# EAGLE design v13 (EAGLE 9.3.0)

## Sheet 1 of 3
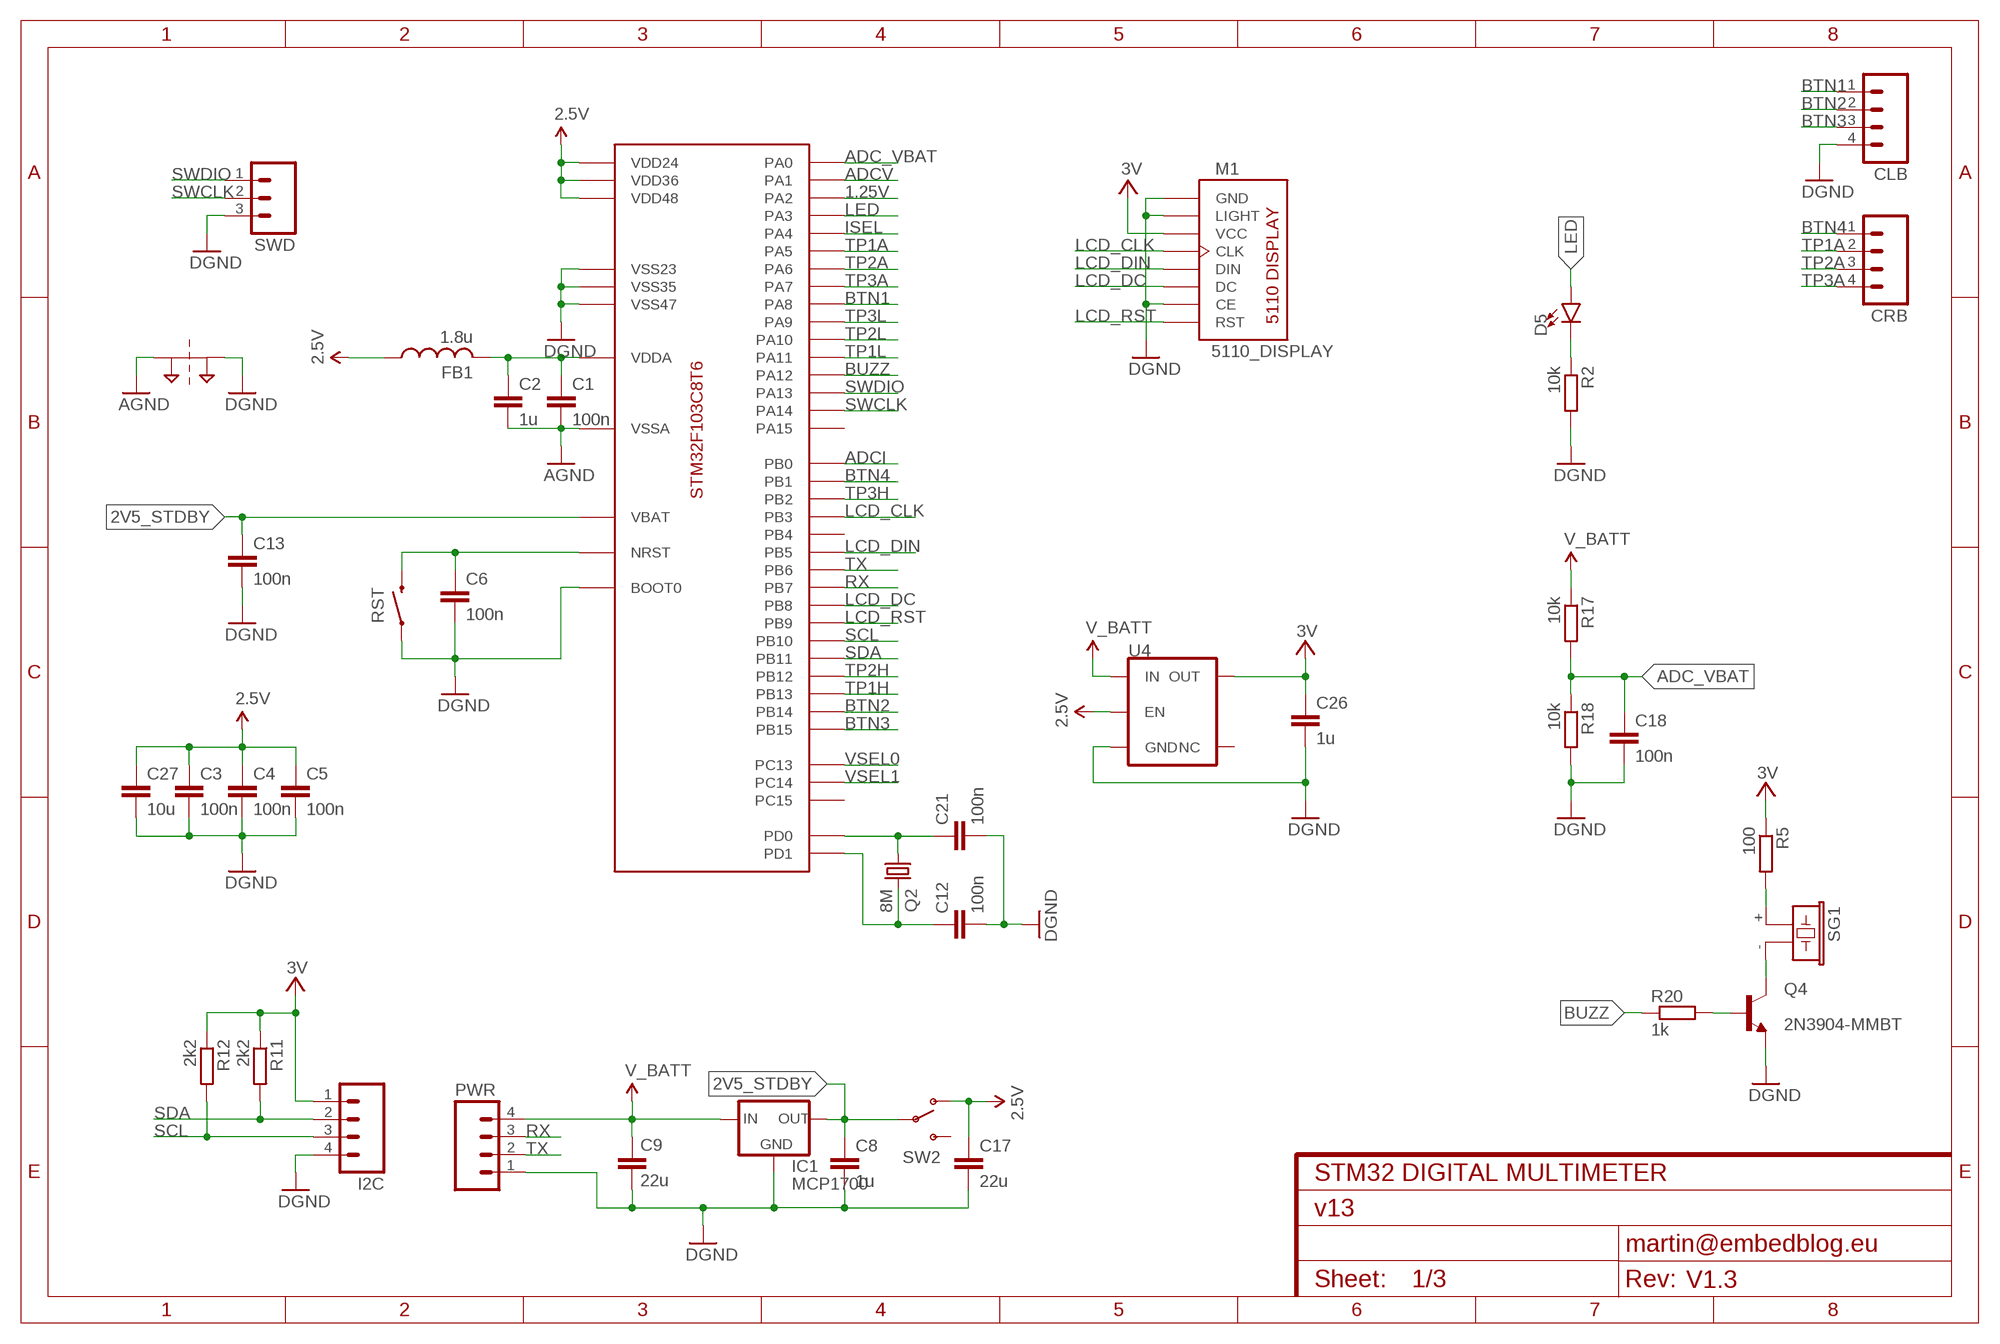
[diagram p0: schematic, sheet 1]
FRAME2 (FRAME-A4L): CNAME: STM32 DIGITAL MULTIMETER; CREVISION: V1.3; DESIGNER: martin@embedblog.eu

### Parts
C1  100n  C-EUC1206  [C1206]
C2  1u  C-EUC1206  [C1206]
C3  100n  C-EUC1206  [C1206]
C4  100n  C-EUC1206  [C1206]
C5  100n  C-EUC1206  [C1206]
C6  100n  C-EUC1206  [C1206]
C8  1u  C-EUC1206  [C1206]
C9  22u  C-EUC1206  [C1206]
C12  100n  C-EUC1206  [C1206]
C13  100n  C-EUC1206  [C1206]
C17  22u  C-EUC1206  [C1206]
C18  100n  C-EUC1206  [C1206]
C21  100n  C-EUC1206  [C1206]
C26  1u  C-EUC1206  [C1206]
C27  10u  C-EUC1206  [C1206]
CLB  M04PTH  [1X04@1]
CRB  M04PTH  [1X04@1]
D5  LED1206  [LED-1206]
FB1  1.8u  FERRITE-BEADC  [1206]
I2C  M04PTH  [1X04@1]
IC1  MCP1700  XC63FPM  [SOT23]
M1  5110_DISPLAY  [5110_LAYOUT]
PWR  M04PTH  [1X04@1]
Q2  8M  CRYSTALHC49U-V  [HC49U-V]
Q4  2N3904-MMBT  [SOT23]
R2  10k  R-EU_R1206  [R1206]
R5  100  R-EU_R1206  [R1206]
R11  2k2  R-EU_R1206  [R1206]
R12  2k2  R-EU_R1206  [R1206]
R17  10k  R-EU_R1206  [R1206]
R18  10k  R-EU_R1206  [R1206]
R20  1k  R-EU_R1206  [R1206]
RST  SWITCH-MOMENTARY-2SMD  [TACTILE-SWITCH-SMD]
SG1  F/CM12P  [F/CM12P]
SJ1  2PT_GND_TIE  [2PT_GND_TIE]
SW2  SK-12D07  [SK12SWITCH]
SWD  M03PTH  [1X03]
U4  3.3V  V_REG_AP2112K-3.3V  [SOT23-5]
U$1  STM32F103C8T6  [TQFP-48]

### Nets
1.25V: U$1.12(PA2) ; also sheet 2
2.5V: C3.1 C4.1 C5.1 C17.1 C27.1 FB1.1 SW2.IN(O) U4.3(EN) U$1.24(VDD24) U$1.36(VDD36) U$1.48(VDD48) ; also sheet 2
2V5_STDBY: C8.1 C13.1 IC1.2(OUT) SW2.P1(P) U$1.1(VBAT)
3V: C26.1 I2C.1 M1.VCC R5.1 R11.1 R12.1 U4.5(OUT) ; also sheet 2
ADC_VBAT: C18.1 R17.2 R18.1 U$1.10(PA0)
ADCI: U$1.18(PB0) ; also sheet 2
ADCV: U$1.11(PA1) ; also sheet 2
AGND: C1.2 C2.2 SJ1.P$1 U$1.8(VSSA) ; also sheet 2
BTN1: CLB.1 U$1.29(PA8)
BTN2: CLB.2 U$1.27(PB14)
BTN3: CLB.3 U$1.28(PB15)
BTN4: CRB.1 U$1.19(PB1)
BUZZ: R20.1 U$1.33(PA12)
GND: C3.2 C4.2 C5.2 C6.2 C8.2 C9.2 C12.2 C13.2 C17.2 C18.2 C21.2 C26.2 C27.2 CLB.4 I2C.4 IC1.1(GND) M1.CE M1.GND M1.LIGHT PWR.1 Q4.2(E) R2.2 R18.2 RST.1 SJ1.P$2 SWD.3 U4.2(GND) U$1.23(VSS23) U$1.35(VSS35) U$1.44(BOOT0) U$1.47(VSS47) ; supply symbol labelled DGND ; also sheet 2
ISEL: U$1.14(PA4) ; also sheet 2
LCD_CLK: M1.CLK U$1.39(PB3)
LCD_DC: M1.DC U$1.45(PB8)
LCD_DIN: M1.DIN U$1.41(PB5)
LCD_RST: M1.RST U$1.46(PB9)
LED: D5.A U$1.13(PA3)
N$1: C6.1 RST.3 U$1.7(NRST)
N$2: C21.1 Q2.1 U$1.5(PD0)
N$8: C1.1 C2.1 FB1.2 U$1.9(VDDA)
N$15: D5.C R2.1
N$16: R5.2 SG1.+
N$21: C12.1 Q2.2 U$1.6(PD1)
N$36: Q4.3(C) SG1.-
N$37: Q4.1(B) R20.2
RX: PWR.3 U$1.43(PB7)
SCL: I2C.3 R12.2 U$1.21(PB10)
SDA: I2C.2 R11.2 U$1.22(PB11)
SWCLK: SWD.2 U$1.37(PA14)
SWDIO: SWD.1 U$1.34(PA13)
TP1A: CRB.2 U$1.15(PA5) ; also sheet 2
TP1H: U$1.26(PB13) ; also sheet 2
TP1L: U$1.32(PA11) ; also sheet 2
TP2A: CRB.3 U$1.16(PA6) ; also sheet 2
TP2H: U$1.25(PB12) ; also sheet 2
TP2L: U$1.31(PA10) ; also sheet 2
TP3A: CRB.4 U$1.17(PA7) ; also sheet 2
TP3H: U$1.20(PB2) ; also sheet 2
TP3L: U$1.30(PA9) ; also sheet 2
TX: PWR.2 U$1.42(PB6)
V_BATT: C9.1 IC1.3(IN) PWR.4 R17.1 U4.1(IN) ; also sheet 3
VSEL0: U$1.2(PC13) ; also sheet 2
VSEL1: U$1.3(PC14) ; also sheet 2
Unconnected: SW2.P2(S) U4.4(NC) U$1.4(PC15) U$1.38(PA15) U$1.40(PB4)

## Sheet 2 of 3
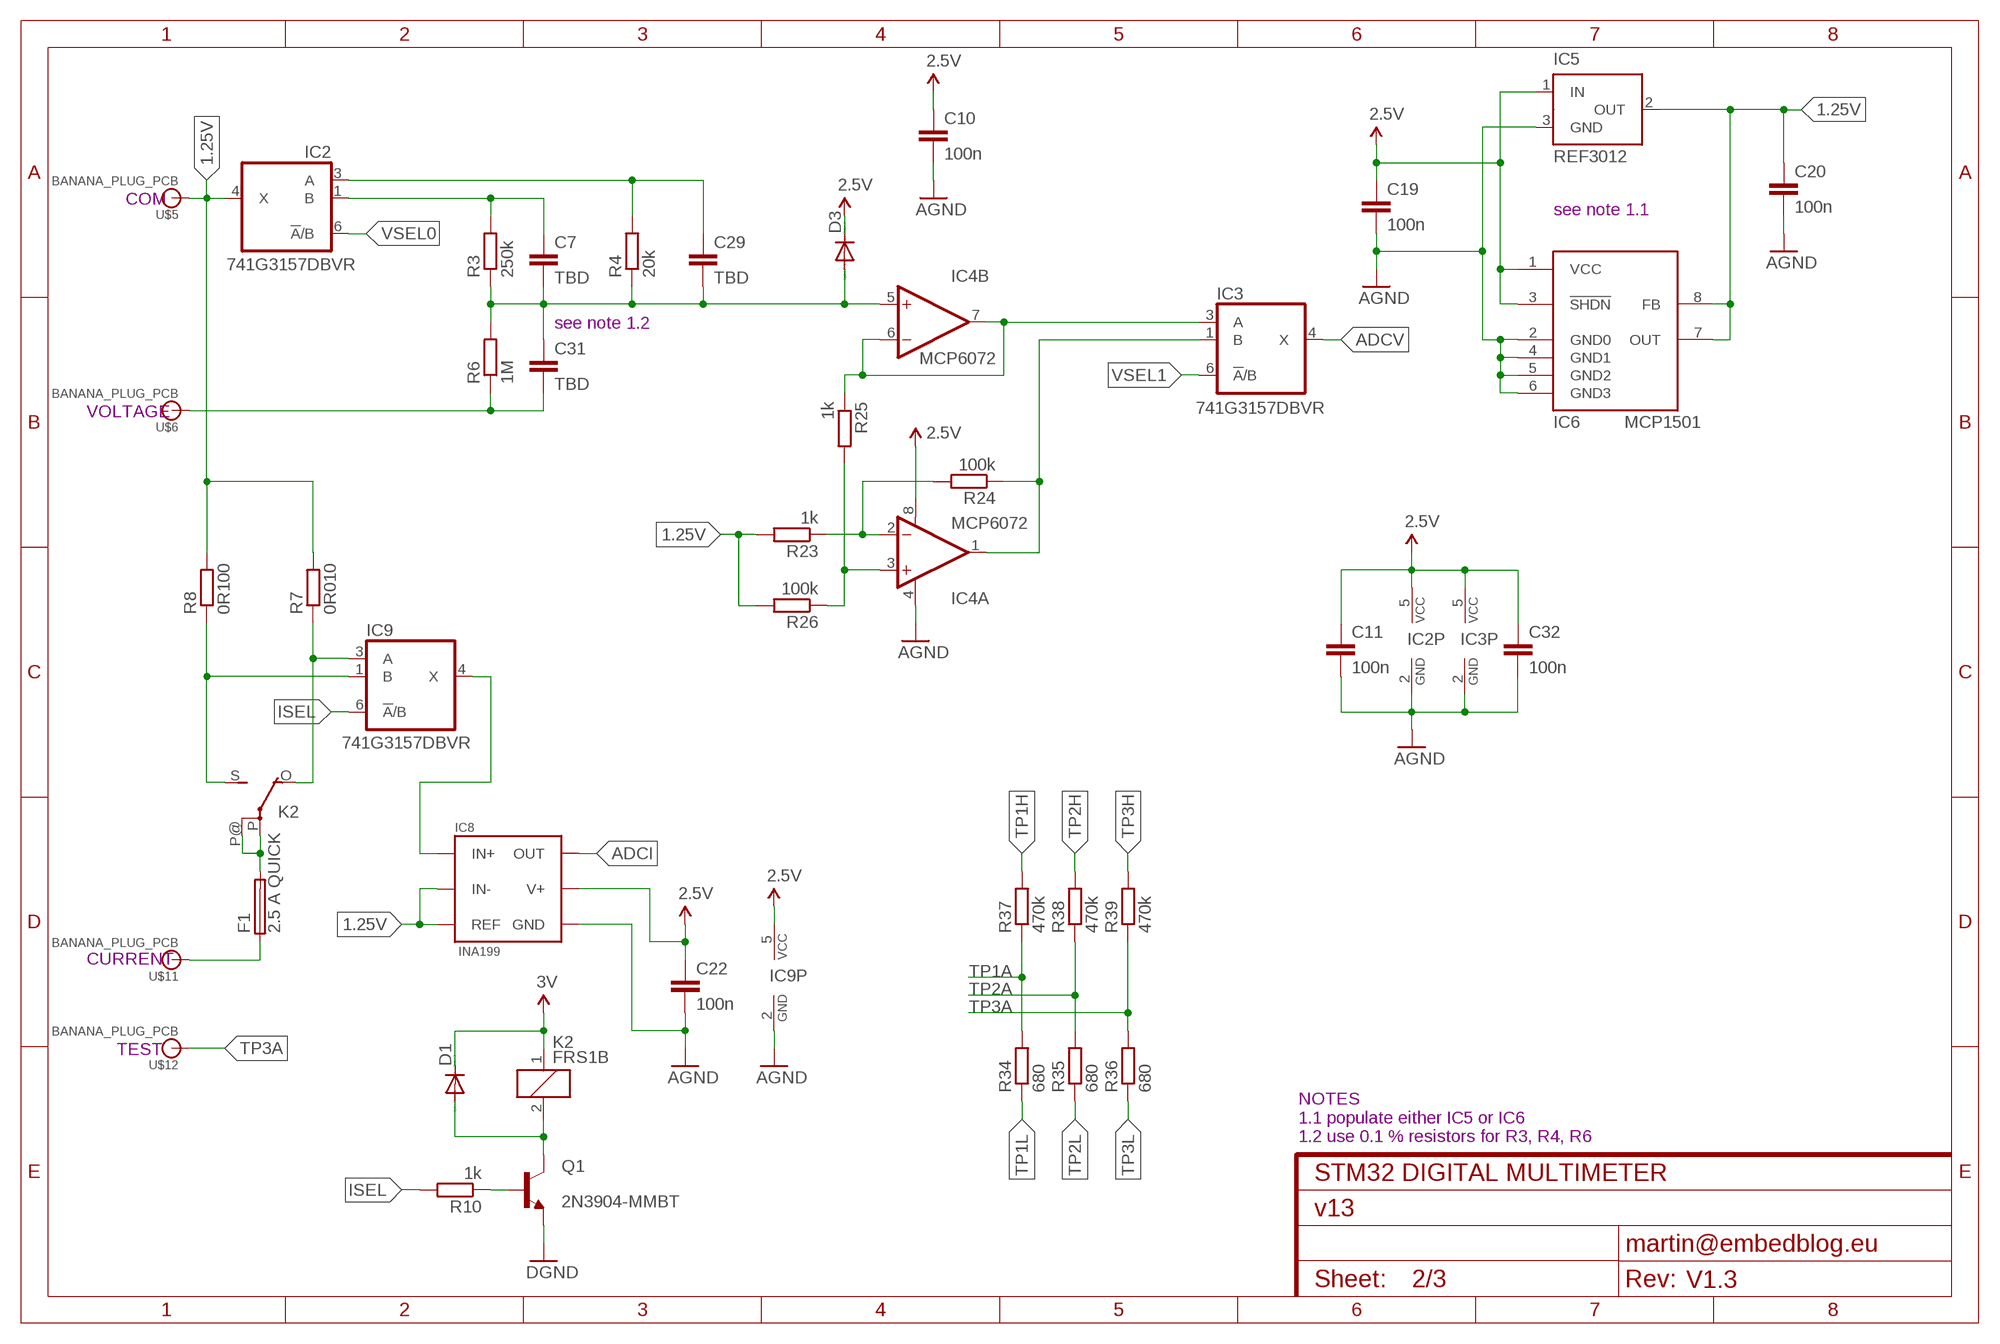
[diagram p1: schematic, sheet 2]
FRAME1 (FRAME-A4L): CNAME: STM32 DIGITAL MULTIMETER; CREVISION: V1.3; DESIGNER: martin@embedblog.eu

### Parts
C7  TBD  CAP1206  [1206]
C10  100n  CAP1206  [1206]
C11  100n  CAP1206  [1206]
C19  100n  C-EUC1206  [C1206]
C20  100n  C-EUC1206  [C1206]
C22  100n  CAP1206  [1206]
C29  TBD  CAP1206  [1206]
C31  TBD  CAP1206  [1206]
C32  100n  CAP1206  [1206]
D1  DIODE-MINIMELF  [MINIMELF]
D3  DIODE-MINIMELF  [MINIMELF]
F1  2.5 A QUICK  FUSESHK20L  [SHK20L]
IC2  741G3157DBVR  [DBV_R-PDSO-G6]
IC3  741G3157DBVR  [DBV_R-PDSO-G6]
IC4  MCP6072  OPAMP-DUALU  [SO08]
IC5  REF3012  MAX6520  [SOT23]
IC6  MCP1501  [SO08]
IC8  INA199  [SC70-6]
IC9  741G3157DBVR  [DBV_R-PDSO-G6]
K2  FRS1B  [FRS1B]
Q1  2N3904-MMBT  [SOT23]
R3  250k  R-EU_R1206  [R1206]
R4  20k  R-EU_R1206  [R1206]
R6  1M  R-EU_R1206  [R1206]
R7  0R010  R-EU_R1206  [R1206]
R8  0R100  R-EU_R1206  [R1206]
R10  1k  R-EU_R1206  [R1206]
R23  1k  R-EU_R1206  [R1206]
R24  100k  R-EU_R1206  [R1206]
R25  1k  R-EU_R1206  [R1206]
R26  100k  R-EU_R1206  [R1206]
R34  680  R-EU_R1206  [R1206]
R35  680  R-EU_R1206  [R1206]
R36  680  R-EU_R1206  [R1206]
R37  470k  R-EU_R1206  [R1206]
R38  470k  R-EU_R1206  [R1206]
R39  470k  R-EU_R1206  [R1206]
U$5  BANANA_PLUG_PCB  [BANANA_6MMHOLE]
U$6  BANANA_PLUG_PCB  [BANANA_6MMHOLE]
U$11  BANANA_PLUG_PCB  [BANANA_6MMHOLE]
U$12  BANANA_PLUG_PCB  [BANANA_6MMHOLE]

### Nets
1.25V: C20.1 IC2.4(X) IC5.2(OUT) IC6.7(OUT) IC6.8(FB) IC8.1(REF) IC8.5(IN-) R7.2 R8.2 R23.2 R26.2 U$5.P$1 ; also sheet 1
2.5V: C10.1 C11.1 C19.1 C22.1 C32.1 D3.C IC2.5(VCC) IC3.5(VCC) IC4.8(A:V+) IC5.1(IN) IC6.1(VCC) IC6.3(!SHDN) IC8.3(V+) IC9.5(VCC) ; also sheet 1
3V: D1.C K2.1 ; also sheet 1
ADCI: IC8.6(OUT) ; also sheet 1
ADCV: IC3.4(X) ; also sheet 1
AGND: C10.2 C11.2 C19.2 C20.2 C22.2 C32.2 IC2.2(GND) IC3.2(GND) IC4.4(A:V-) IC5.3(GND) IC6.2(GND0) IC6.4(GND1) IC6.5(GND2) IC6.6(GND3) IC8.2(GND) IC9.2(GND) ; also sheet 1
GND: Q1.2(E) ; supply symbol labelled DGND ; also sheet 1
ISEL: IC9.6(!A!/B) R10.2 ; also sheet 1
N$3: C7.1 IC2.1(B) R3.2
N$4: C29.1 IC2.3(A) R4.2
N$5: C7.2 C29.2 C31.1 D3.A IC4.5(B:+IN) R3.1 R4.1 R6.2
N$6: Q1.1(B) R10.1
N$7: F1.2A K2.P(2:P) K2.P@(2:P)
N$9: C31.2 R6.1 U$6.P$1
N$10: IC9.1(B) K2.S(2:S) R8.1
N$11: D1.A K2.2 Q1.3(C)
N$12: IC9.3(A) K2.O(2:O) R7.1
N$18: IC8.4(IN+) IC9.4(X)
N$22: F1.1A U$11.P$1
N$39: IC3.1(B) IC4.1(A:OUT) R24.1
N$40: IC4.2(A:-IN) R23.1 R24.2
N$41: IC4.3(A:+IN) R25.2 R26.1
N$42: IC3.3(A) IC4.6(B:-IN) IC4.7(B:OUT) R25.1
TP1A: R34.2 R37.1 ; also sheet 1
TP1H: R37.2 ; also sheet 1
TP1L: R34.1 ; also sheet 1
TP2A: R35.2 R38.1 ; also sheet 1
TP2H: R38.2 ; also sheet 1
TP2L: R35.1 ; also sheet 1
TP3A: R36.2 R39.1 U$12.P$1 ; also sheet 1
TP3H: R39.2 ; also sheet 1
TP3L: R36.1 ; also sheet 1
VSEL0: IC2.6(!A!/B) ; also sheet 1
VSEL1: IC3.6(!A!/B) ; also sheet 1

### Notes on the sheet
- COM
- see note 1.1
- see note 1.2
- VOLTAGE
- CURRENT
- TEST
- NOTES
  1.1 populate either IC5 or IC6
  1.2 use 0.1 % resistors for R3, R4, R6

## Sheet 3 of 3
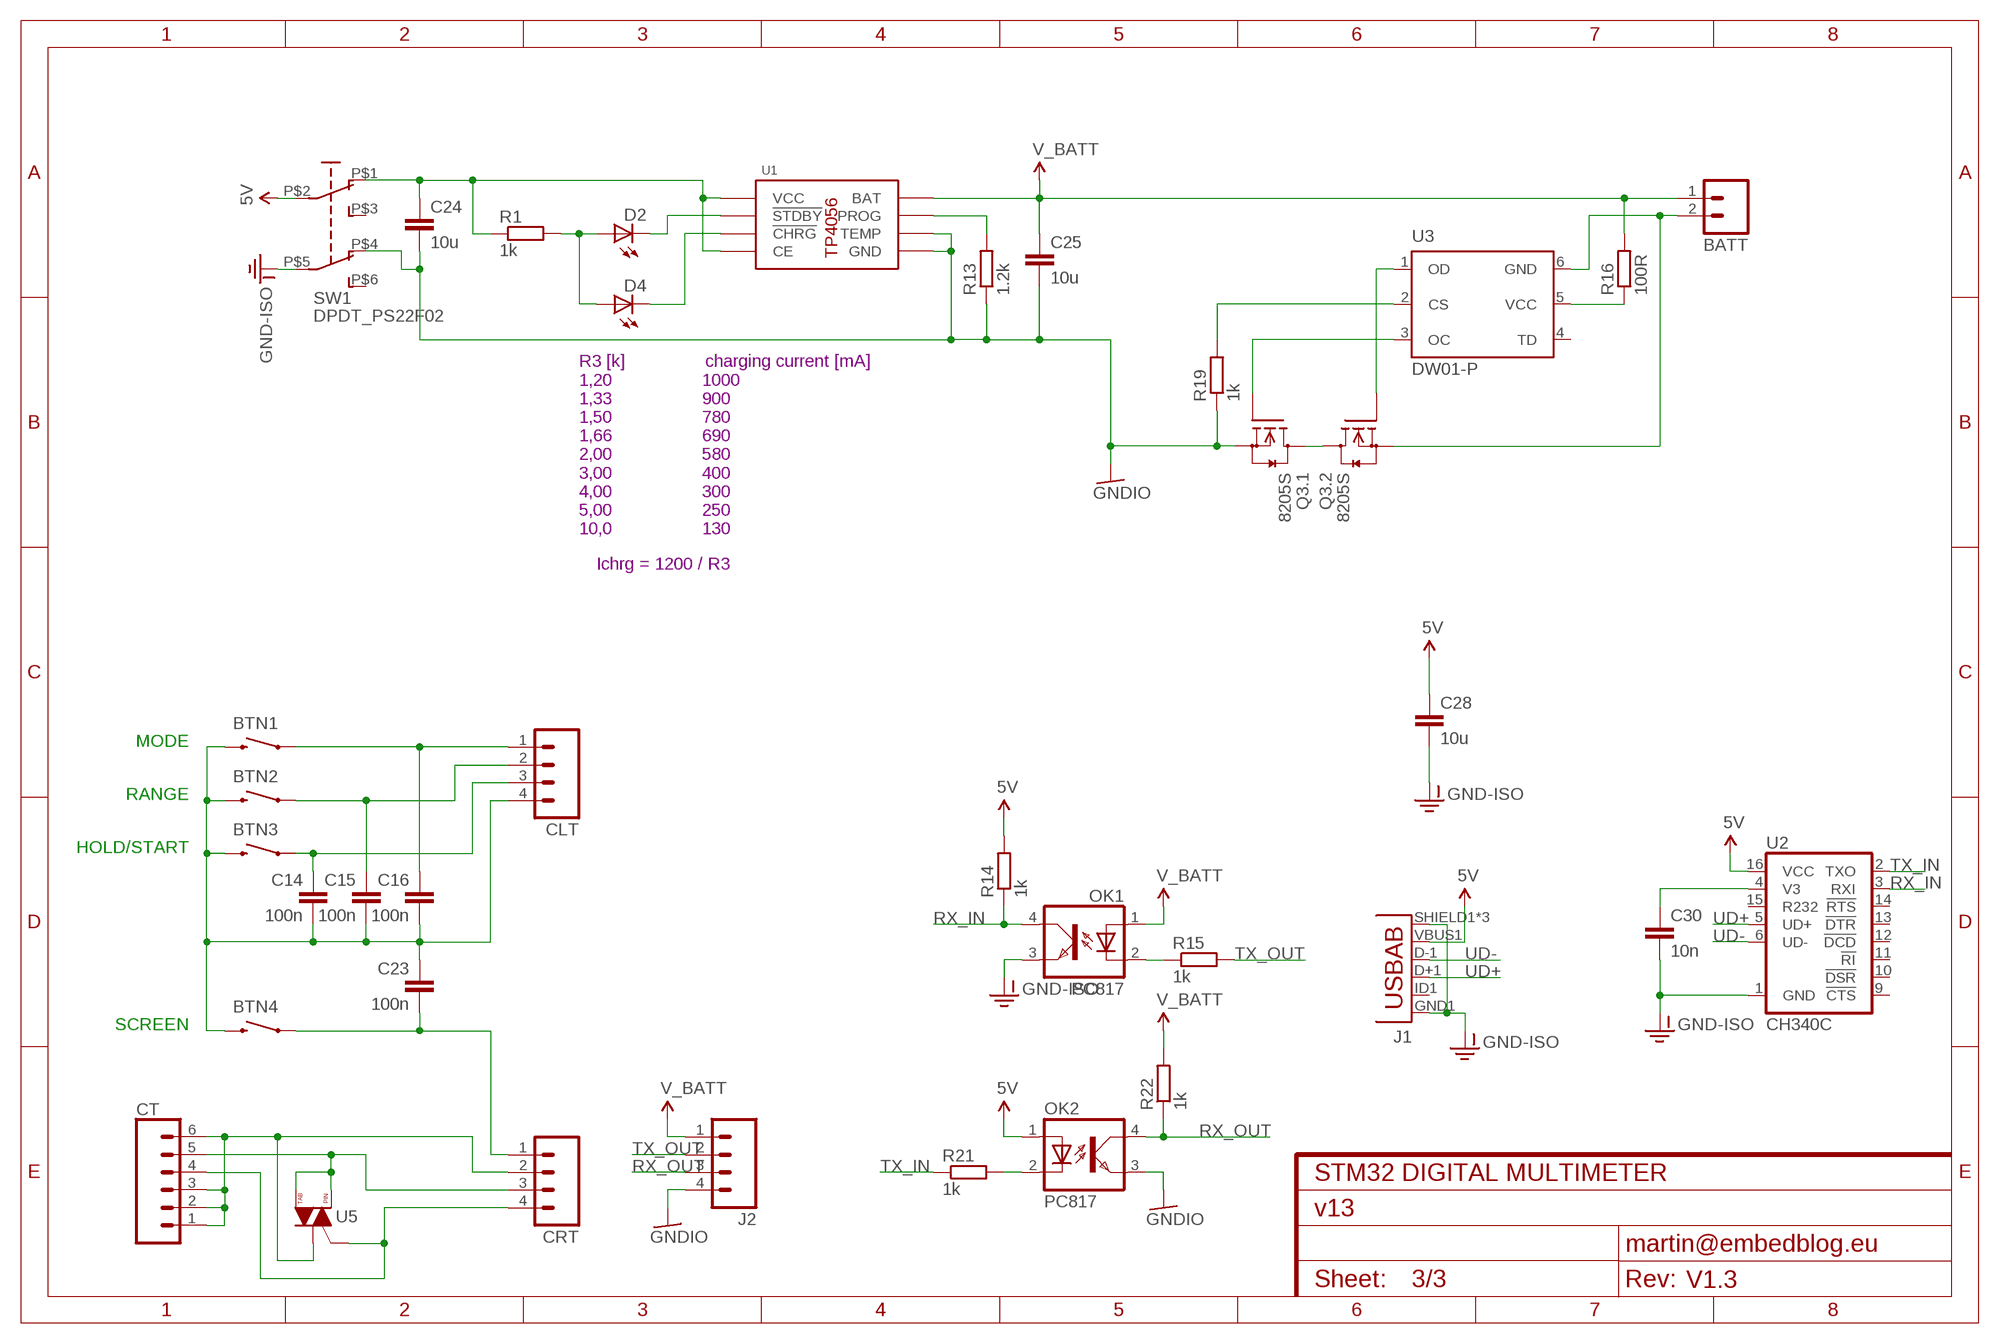
[diagram p2: schematic, sheet 3]
FRAME3 (FRAME-A4L): CNAME: STM32 DIGITAL MULTIMETER; CREVISION: V1.3; DESIGNER: martin@embedblog.eu

### Parts
BATT  M02PTH3  [1X02_LONGPADS]
BTN1  SWITCH-MOMENTARY-2PTH  [TACTILE-PTH]
BTN2  SWITCH-MOMENTARY-2PTH  [TACTILE-PTH]
BTN3  SWITCH-MOMENTARY-2PTH  [TACTILE-PTH]
BTN4  SWITCH-MOMENTARY-2PTH  [TACTILE-PTH]
C14  100n  C-EUC1206  [C1206]
C15  100n  C-EUC1206  [C1206]
C16  100n  C-EUC1206  [C1206]
C23  100n  C-EUC1206  [C1206]
C24  10u  C-EUC1206  [C1206]
C25  10u  C-EUC1206  [C1206]
C28  10u  C-EUC1206  [C1206]
C30  10n  C-EUC1206  [C1206]
CLT  M04PTH  [1X04@1]
CRT  M04PTH  [1X04@1]
CT  CONN_06NO_SILK_FEMALE_PTH  [1X06_NO_SILK]
D2  LEDCHIPLED_1206  [CHIPLED_1206]
D4  LEDCHIPLED_1206  [CHIPLED_1206]
J1  USB-ABCONN-11794  [USB-AB-MICRO-SMD_V03]
J2  M04PTH  [1X04@1]
OK1  PC817  [DIL04]
OK2  PC817  [DIL04]
Q3  8205S  FDC6305N  [SSOT-6]
R1  1k  R-EU_R1206  [R1206]
R13  1.2k  R-EU_R1206  [R1206]
R14  1k  R-EU_R1206  [R1206]
R15  1k  R-EU_R1206  [R1206]
R16  100R  R-EU_R1206  [R1206]
R19  1k  R-EU_R1206  [R1206]
R21  1k  R-EU_R1206  [R1206]
R22  1k  R-EU_R1206  [R1206]
SW1  DPDT_PS22F02  [PS22_L02_DPDT_SW]
U1  TP4056  [SOP8]
U2  CH340C  [SO016]
U3  DW01-P  [SOT23-6L]
U5  TRIAC-HPSMD  [SOT223]

### Nets
5V: C28.1 J1.VBUS1(VBUS) OK2.1(A) R14.2 SW1.P$2(P) U2.16(VCC)
5V_ISO: C24.1 R1.1 SW1.P$1(O) U1.4(VCC) U1.8(CE)
BTN1T: BTN1.1 C16.1 CLT.1
BTN2T: BTN2.1 C15.1 CLT.2
BTN3T: BTN3.1 C14.1 CLT.3
GND-ISO: C28.2 C30.2 J1.GND1(GND) J1.SHIELD1(SHIELD) J1.SHIELD2(SHIELD) J1.SHIELD3(SHIELD) OK1.3(EMIT) SW1.P$5(P1) U2.1(GND)
GNDIO: C24.2 C25.2 J2.4 OK2.3(EMIT) Q3.5(.1:S) R13.1 R19.1 SW1.P$4(O1) U1.1(TEMP) U1.3(GND)
N$13: D2.A D4.A R1.2
N$14: BTN1.3 BTN2.3 BTN3.3 BTN4.3 C14.2 C15.2 C16.2 C23.1 CLT.4
N$17: BTN4.1 C23.2 CRT.1
N$23: D2.C U1.6(!STDBY)
N$25: D4.C U1.7(!CHRG)
N$26: R13.2 U1.2(PROG)
N$27: C30.1 U2.4(V3)
N$28: OK2.2(C) R21.2
N$29: OK1.2(C) R15.1
N$30: R16.1 U3.5(VCC)
N$31: BATT.2 Q3.2(.2:S) U3.6(GND)
N$32: Q3.4(.2:D) Q3.6(.1:D)
N$33: Q3.3(.2:G) U3.1(OD)
N$34: Q3.1(.1:G) U3.3(OC)
N$35: R19.2 U3.2(CS)
RX_IN: OK1.4(COL) R14.1 U2.3(RXI)
RX_OUT: J2.3 OK2.4(COL) R22.1
TPA1_TOP: CRT.2 CT.1 CT.2 CT.3 CT.6 U5.1(T1)
TPA2_TOP: CRT.3 CT.5 U5.2(T2) U5.4(T2)
TPA3_TOP: CRT.4 CT.4 U5.3(G)
TX_IN: R21.1 U2.2(TXO)
TX_OUT: J2.2 R15.2
UD+: J1.D+1(D+) U2.5(UD+)
UD-: J1.D-1(D-) U2.6(UD-)
V_BATT: BATT.1 C25.1 J2.1 OK1.1(A) R16.2 R22.2 U1.5(BAT) ; also sheet 1
Unconnected: J1.ID1(USBID) SW1.P$3(S) SW1.P$6(S1) U2.9(!CTS) U2.10(!DSR) U2.11(!RI) U2.12(!DCD) U2.13(!DTR) U2.14(!RTS) U2.15(R232) U3.4(TD)

### Notes on the sheet
- R3 [k]                charging current [mA]
  1,20                  1000
  1,33                  900
  1,50                  780
  1,66                  690
  2,00                  580
  3,00                  400
  4,00                  300
  5,00                  250
  10,0                  130
- Ichrg = 1200 / R3
- MODE
- RANGE
- HOLD/START
- SCREEN

## Library data of the parts
BATT = SparkFun-Connectors:M02: Standard 2-pin 0.1" header. Use with - straight break away headers ( PRT-00116) - right angle break away headers (PRT-00553) - swiss pins (PRT-00743) - machine pins (PRT-00117) - female headers (PRT-00115) Molex polarized connector foot print use with: PRT-08233 with associated crimp pins and housings. 2.54_SCREWTERM for use with PRT-10571. 3.5mm Screw Terminal footprints for PRT-08084 5mm Screw Terminal footprints for use with PRT-08432
BTN1-BTN4 = SparkFun-Electromechanical:SWITCH-MOMENTARY-2: Various NO switches- pushbuttons, reed, etc; PROD_ID: SWCH-08441
C1-C6 C8 C9 C12-C21 C23-C28 C30 = resistor:C-EU: CAPACITOR, European symbol
C7 C10 C11 C22 C29 C31 C32 = SparkFun-Passives:CAP: Capacitor Standard 0603 ceramic capacitor, and 0.1" leaded capacitor.
CLB CLT CRB CRT I2C J2 PWR = SparkFun-Connectors:M04: Header 4 Standard 4-pin 0.1" header. Use with straight break away headers (SKU : PRT-00116), right angle break away headers (PRT-00553), swiss pins (PRT-00743), machine pins (PRT-00117), and female headers (PRT-00115). Molex polarized connector foot print use with SKU : PRT-08231 with associated crimp pins and housings. 1MM SMD Version SKU: PRT-10208; PROD_ID: CONN-09696
CT = SparkFun-Connectors:CONN_06: Multi connection point. Often used as Generic Header-pin footprint for 0.1 inch spaced/style header connections On any of the 0.1 inch spaced packages, you can populate with these: Break Away Headers - Straight <https://www.sparkfun.com/products/116> (PRT-00116) Break Away Male Headers - Right Angle <https://www.sparkfun.com/products/553> (PRT-00553) Female Headers <https://www.sparkfun.com/products/115> (PRT-00115) Break Away Headers - Machine Pin <https://www.sparkfun.com/products/117> (PRT-00117) Break Away Female Headers - Swiss Machine Pin <https://www.sparkfun.com/products/743> (PRT-00743) Arduino Stackable Header - 6 Pin <https://www.sparkfun.com/products/9280> (PRT-09280) For SCREWTERMINALS and SPRING TERMINALS visit here: Screw Terimnals on SparkFun.com <https://www.sparkfun.com/search/results?term=Screw+Terminals> (5mm/3.5mm/2.54mm spacing) This device is also useful as a general connection point to wire up your design to another part of your project. Our various solder wires solder well into these plated through hole pads. Hook-Up Wire - Assortment (Stranded, 22 AWG) <https://www.sparkfun.com/products/11375> (PRT-11375) Hook-Up Wire - Assortment (Solid Core, 22 AWG) <https://www.sparkfun.com/products/11367> (PRT-11367) View the entire wire category on our website here <https://www.sparkfun.com/categories/141>; PROD_ID: CONN-08437
D1 D3 = diode:DIODE-: DIODE
D2 D4 = led:LED: LED OSRAM: - CHIPLED LG R971, LG N971, LY N971, LG Q971, LY Q971, LO R971, LY R971 LH N974, LH R974 LS Q976, LO Q976, LY Q976 LO Q996 - Hyper CHIPLED LW Q18S LB Q993, LB Q99A, LB R99A - SideLED LS A670, LO A670, LY A670, LG A670, LP A670 LB A673, LV A673, LT A673, LW A673 LH A674 LY A675 LS A676, LA A676, LO A676, LY A676, LW A676 LS A679, LY A679, LG A679 - Hyper Micro SIDELED® LS Y876, LA Y876, LO Y876, LY Y876 LT Y87S - SmartLED LW L88C, LW L88S LB L89C, LB L89S, LG L890 LS L89K, LO L89K, LY L89K LS L896, LA L896, LO L896, LY L896 - TOPLED LS T670, LO T670, LY T670, LG T670, LP T670 LSG T670, LSP T670, LSY T670, LOP T670, LYG T670 LG T671, LOG T671, LSG T671 LB T673, LV T673, LT T673, LW T673 LH T674 LS T676, LA T676, LO T676, LY T676, LB T676, LH T676, LSB T676, LW T676 LB T67C, LV T67C, LT T67C, LS T67K, LO T67K, LY T67K, LW E67C LS E67B, LA E67B, LO E67B, LY E67B, LB E67C, LV E67C, LT E67C LW T67C LS T679, LY T679, LG T679 LS T770, LO T770, LY T770, LG T770, LP T770 LB T773, LV T773, LT T773, LW T773 LH T774 LS E675, LA E675, LY E675, LS T675 LS T776, LA T776, LO T776, LY T776, LB T776 LHGB T686 LT T68C, LB T68C - Hyper Mini TOPLED® LB M676 - Mini TOPLED Santana® LG M470 LS M47K, LO M47K, LY M47K Source: http://www.osram.convergy.de LUXEON: - LUMILED® LXK2-PW12-R00, LXK2-PW12-S00, LXK2-PW14-U00, LXK2-PW14-V00 LXK2-PM12-R00, LXK2-PM12-S00, LXK2-PM14-U00 LXK2-PE12-Q00, LXK2-PE12-R00, LXK2-PE12-S00, LXK2-PE14-T00, LXK2-PE14-U00 LXK2-PB12-K00, LXK2-PB12-L00, LXK2-PB12-M00, LXK2-PB14-N00, LXK2-PB14-P00, LXK2-PB14-Q00 LXK2-PR12-L00, LXK2-PR12-M00, LXK2-PR14-Q00, LXK2-PR14-R00 LXK2-PD12-Q00, LXK2-PD12-R00, LXK2-PD12-S00 LXK2-PH12-R00, LXK2-PH12-S00 LXK2-PL12-P00, LXK2-PL12-Q00, LXK2-PL12-R00 Source: www.luxeon.com KINGBRIGHT: KA-3528ASYC Source: www.kingbright.com
D5 = SparkFun-LED:LED: LED (Generic) Standard schematic elements and footprints for 5mm, 3mm, 1206, and 0603 sized LEDs. Generic LEDs with no color specified.
F1 = fuse:FUSE: Fuse; OC_FARNELL: unknown; OC_NEWARK: unknown
FB1 = m-pad-2.1:FERRITE-BEAD: Ferrite beads in various packages
IC1 = v-reg:XC63FP: Positiv Voltage Regulators www.torex.co.jp/english/product/pro02/pdf/0201_xc62fp.pdf
IC2 IC3 IC9 = 74xx-little-de:74*1G3157: Single-Pole, Double-Throw Analog Switch Source: http://focus.ti.com/lit/ds/symlink/sn74lvc1g3157.pdf
IC4 = SparkFun-AnalogIC:OPAMP-DUAL: Generic op-amp footprint
IC5 = maxim:MAX6520: 1.2V Voltage Reference 50ppm/°C, SOT23, 3-Terminal Source: Data sheet <http://datasheets.maxim-ic.com/en/ds/MAX6520.pdf>; MF: MAXIM; MPN: MAX6520EUR-T; OC_FARNELL: unknown; OC_NEWARK: 02J4586
IC6 = custom:MCP1501
IC8 = custom:INA199
J1 = SparkFun-Connectors:USB-AB: This is a USB AB connector that is compatible with USB OTG. i.e. this connector can serve as a host or device; PROD_ID: CONN-11794
K2 = relay:FRS1B: RELAY 1 x switch, same as V23101-D6-A201, Siemens; OC_FARNELL: unknown; OC_NEWARK: unknown
M1 = custom:5110_DISPLAY
OK1 OK2 = optocoupler:PC817: SHARP OPTO COUPLER; MPN: PC817X4J000F; OC_FARNELL: 9707727; OC_NEWARK: 97K7059
Q1 Q4 = m-pad-2.1:2N3904: NPN TRANSISTOR
Q2 = crystal:CRYSTAL: CRYSTAL; OC_FARNELL: 1666969; OC_NEWARK: unknown
Q3 = m-pad-2.1:FDC6305N: Fairchild's FDC6305N Dual N-Channel 2.5V Specified PowerTrenchTM MOSFET General Description: These N-Channel low threshold 2.5V specified MOSFETs are produced using Fairchild Semiconductor's advanced PowerTrench process that has been especially tailored to minimize on-state resistance and yet maintain low gate charge for superior switching performance. Features: 2.7 A, 20 V. RDS(ON) = 0.08Ohm @ VGS = 4.5 V RDS(ON) = 0.12Ohm @ VGS = 2.5 V Low gate charge (3.5nC typical). Fast switching speed. High performance trench technology for extremely low RDS(ON). SuperSOTTM-6 package: small footprint (72% smaller than standard SO-8); low profile (1mm thick). Applications: Load switch DC/DC converter Motor driving Please send any comments to: messi@users.sourceforge.net
R1-R8 R10-R26 R34-R39 = resistor:R-EU_: RESISTOR, European symbol
RST = SparkFun-Electromechanical:SWITCH-MOMENTARY-2: Various NO switches- pushbuttons, reed, etc; PROD_ID: SWCH-08247
SG1 = buzzer:F/CM12P: BUZZER Source: Buerklin; OC_FARNELL: unknown; OC_NEWARK: unknown
SJ1 = SparkFun-Passives:2PT_GND_TIE: Package for connecting two ground nets in one place.
SW1 = custom:DPDT_PS22F02
SW2 = custom:SK-12D07
SWD = SparkFun-Connectors:M03: Header 3 Standard 3-pin 0.1" header. Use with straight break away headers (SKU : PRT-00116), right angle break away headers (PRT-00553), swiss pins (PRT-00743), machine pins (PRT-00117), and female headers (PRT-00115). Molex polarized connector foot print use with SKU : PRT-08232 with associated crimp pins and housings.
U1 = custom:TP4056
U2 = SparkFun-IC-Comms:CH340C; PROD_ID: IC-14038
U3 = lipo:DW01-P: One Cell Lithium-ion/Polymer Battery Protection IC The DW01-P battery protection IC is designed to protect lithium-ion/polymer battery from damage or degrading the lifetime due to overcharge, overdischarge, and/or overcurrent for one-cell lithium-ion/polymer battery powered systems, such as cellular phones. The ultra-small package and less required external components make it ideal to integrate the DW01-P into the limited space of battery pack. The accurate ±50mV overcharging detection voltage ensures safe and full utilization charging. The very low standby current drains little current from the cell while in storage.
U4 = SparkFun-IC-Power:V_REG_AP2112: AP2112 - 600mA CMOS LDO Regulator w/ Enable The AP2112 is CMOS process low dropout linear regulator with enable function, the regulator delivers a guaranteed 600mA (min.) continuous load current. Features Output Voltage Accuracy: ±1.5% Output Current: 600mA (Min.) Foldback Short Current Protection: 50mA Enable Function to Turn ON/OFF VOUT Low Dropout Voltage (3.3V): 250mV (Typ.) @IOUT=600mA Excellent Load Regulation: 0.2%/A (Typ.) Excellent Line Regulation: 0.02%/V (Typ.) Low Quiescent Current: 55μA (Typ.) Low Standby Current: 0.01μA (Typ.) Low Output Noise: 50μVRMS PSRR: 100Hz -65dB, 1kHz -65dB OTSD Protection Stable with 1.0μF Flexible Cap: Ceramic, Tantalum and Aluminum Electrolytic Operation Temperature Range: -40°C to 85°C ESD: MM 400V, HBM 4000V; PROD_ID: VREG-12457
U5 = SparkFun-DiscreteSemi:TRIAC-HP: TRIAC High Power Used for EL wire applications; PROD_ID: VREG-09120
U$1 = SparkFun-DigitalIC:STM32F103C8T6
U$5 U$6 U$11 U$12 = custom:BANANA_PLUG_PCB

## Board
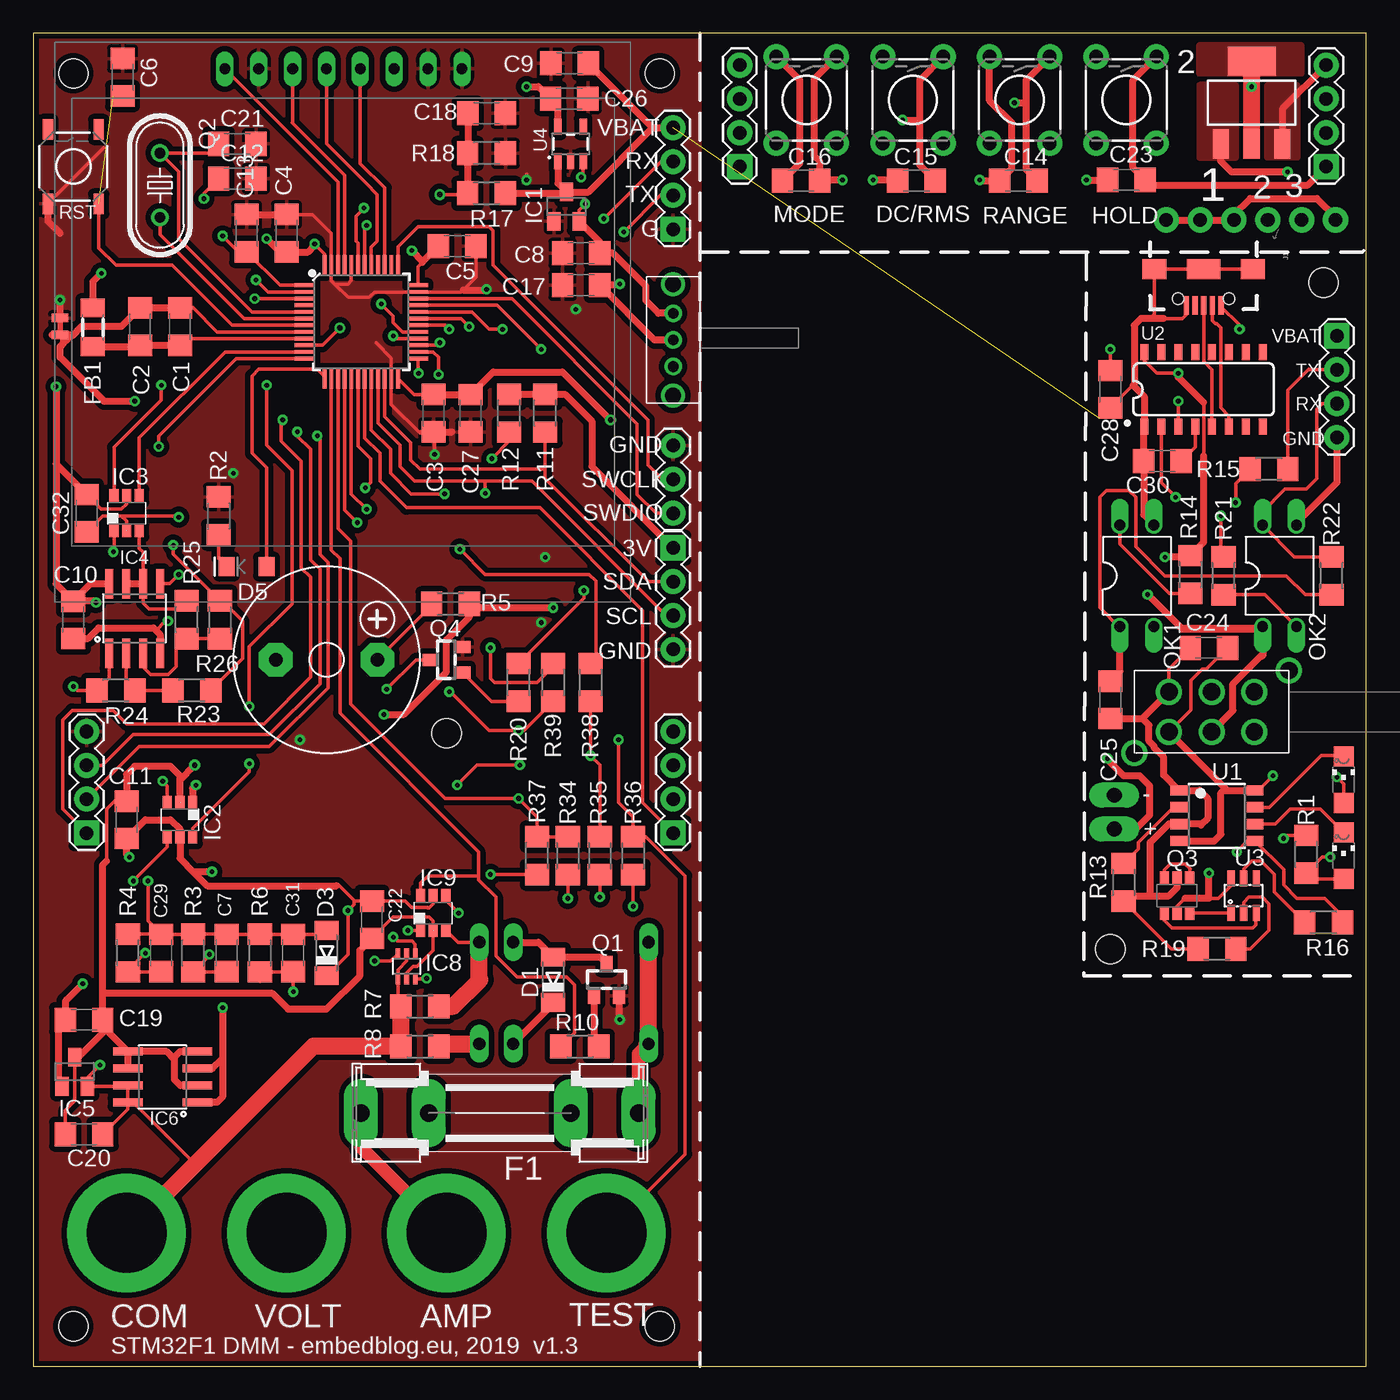
[diagram p3: board, top side]
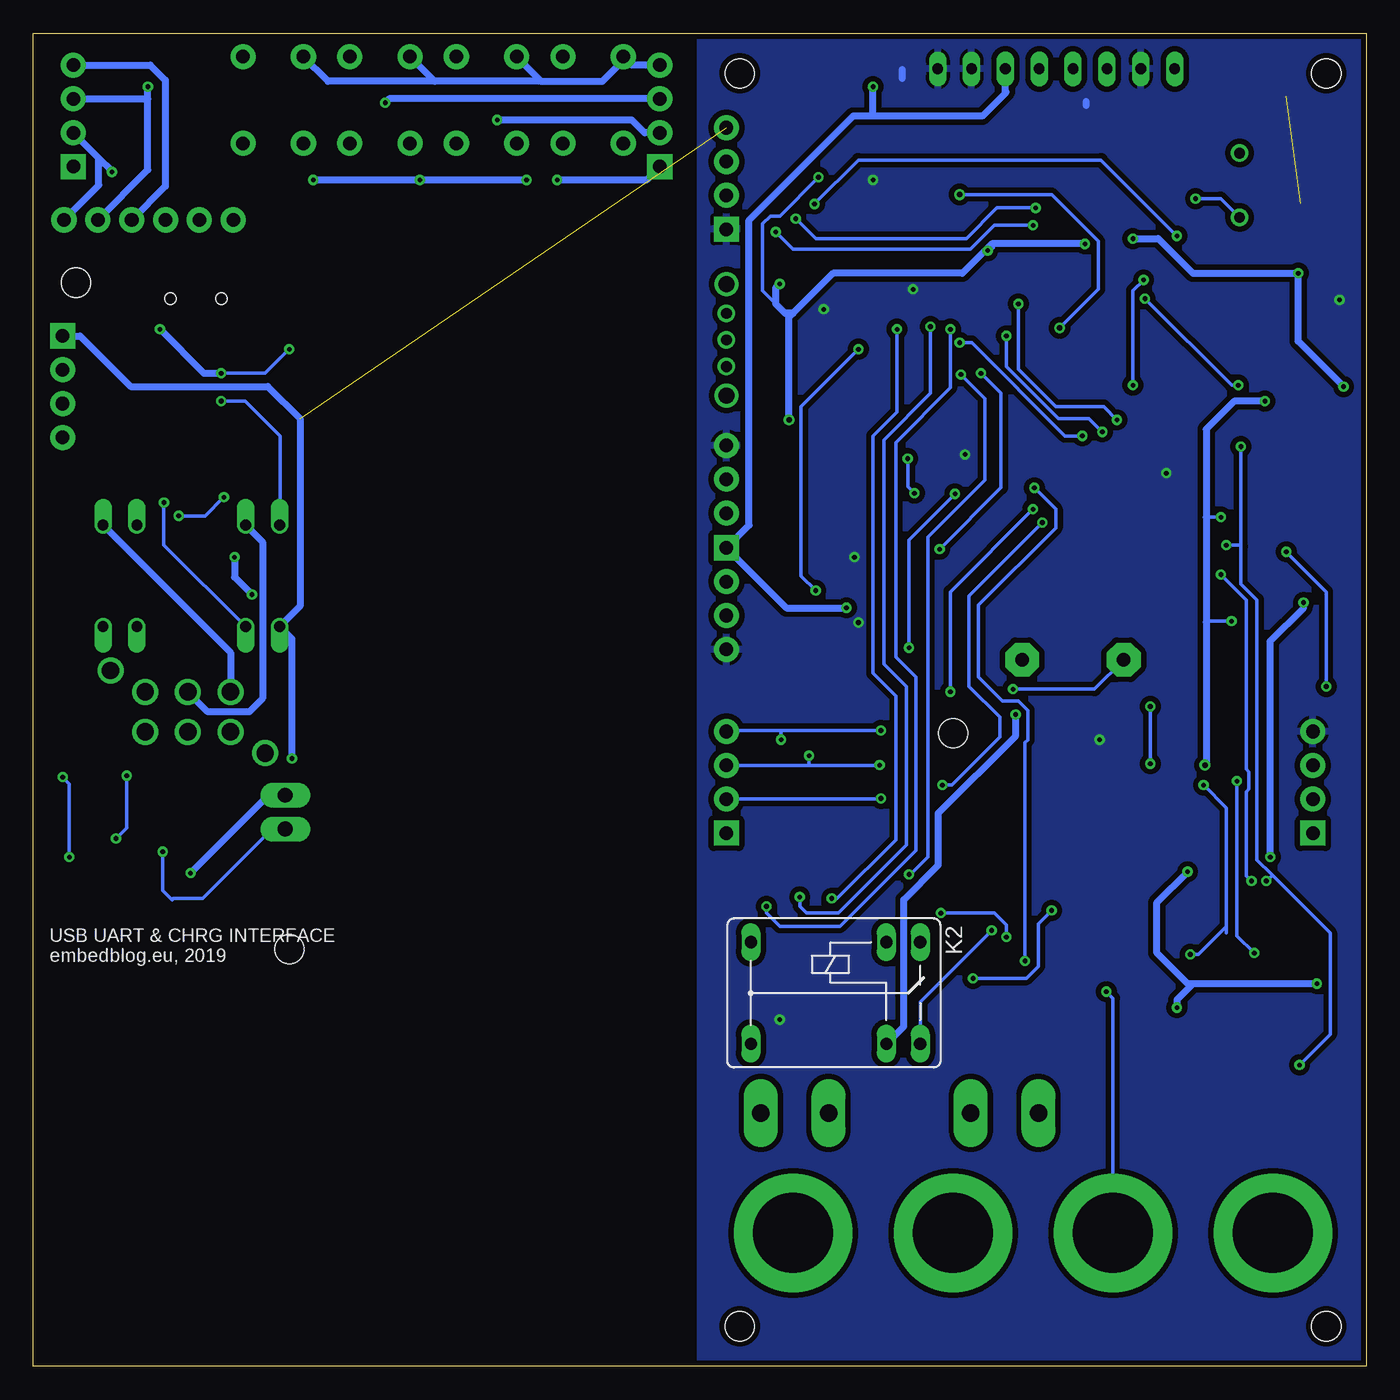
[diagram p4: board, bottom side, seen from below]

Size 100 x 100 mm. Coordinates in mm from the lower left corner, seen from the top.
Outline: 0,0 100,0 100,100 0,100 0,0
Copper layers (1*16): Top 0.035mm / dielectric 1.5mm / Bottom 0.035mm
Design rules "default *": minimum track width 6mil, minimum drill 0.2mm, track to track 6mil, track to pad 6mil, pad to pad 6mil, via to via 6mil, smd to smd 6mil, copper to edge 0.3mm, drill to drill 6mil, minimum pad ring 10mil, minimum via ring 8mil, stop-mask expansion 4mil, vias tented up to drill 0mil, thermal gap 10mil
Holes 2.2 mm at 47,3 3,97 47,97 3,3 96.8,81.3 80.8,31.3 31,47.5

### Footprints (pad centres in the part's own frame; a part is rotated, then mirrored left to right if it is on the bottom)
1X02_LONGPADS = drill 1.118 pad 1.88 long: 1 0,0; 2 2.54,0
TACTILE-PTH = drill 1.016 pad 1.88: 1 -3.251,2.261; 2 3.251,2.261; 3 -3.251,-2.261; 4 3.251,-2.261
C1206 = smd 1.6 x 1.8: 1 -1.4,0; 2 1.4,0
1206 = smd 1.6 x 1.8: 1 -1.4,0; 2 1.4,0
1X04@1 = drill 1.016 pad 1.88 square: 1 0,0 | drill 1.016 pad 1.88: 2 2.54,0; 3 5.08,0; 4 7.62,0
1X06_NO_SILK = drill 1.016 pad 1.88: 1 0,0; 2 2.54,0; 3 5.08,0; 4 7.62,0; 5 10.16,0; 6 12.7,0
MINIMELF = smd 1.4 x 1.8: A 1.7,0; C -1.7,0
CHIPLED_1206 = smd 1.5 x 1.5: A 0,-1.75; C 0,1.75
LED-1206 = smd 1.2 x 1.4: A -1.5,0; C 1.5,0
SHK20L = drill 1.321 pad 2.54 long: 1A -10.414,0; 1B -5.334,0; 2A 10.414,0; 2B 5.334,0
1206' = smd 1.4 x 1.8: 1 -1.45,0; 2 1.45,0
SOT23 = smd 1 x 1.4: 1 -0.95,-1.1; 2 0.95,-1.1; 3 0,1.1
DBV_R-PDSO-G6 = smd 0.69 x 0.99: 1 -0.95,-1.29; 2 0,-1.29; 3 0.95,-1.29; 4 0.95,1.3; 5 0,1.3; 6 -0.95,1.3
SO08 = smd 0.61 x 2.21: 1 -1.905,-2.616; 2 -0.635,-2.616; 3 0.635,-2.616; 4 1.905,-2.616; 5 1.905,2.616; 6 0.635,2.616; 7 -0.635,2.616; 8 -1.905,2.616
SC70-6 = smd 0.35 x 0.8: 1 -0.65,-0.95; 2 0,-0.95; 3 0.65,-0.95; 4 0.65,0.95; 5 0,0.95; 6 -0.65,0.95
USB-AB-MICRO-SMD_V03 = smd 1.4 x 0.4: D+1 2.7,0; D-1 2.7,0.65; GND1 2.7,-1.3; ID1 2.7,-0.65; VBUS1 2.7,1.3 | smd 1.5 x 1.8: SHIELD1 0,3.68; SHIELD3 0,-3.68 | smd 1.5 x 2.5: SHIELD2 0,0 | hole 0.85: 2.2,1.9; 2.2,-1.9
FRS1B = drill 0.914 long: 1 0,3.81; 2 0,-3.81; O -2.54,-3.81; P 10.16,3.81; P@ 10.16,-3.81; S -2.54,3.81
5110_LAYOUT = drill 0.8 long: CE 0,-5.08; CLK 0,2.54; DC 0,-2.54; DIN 0,0; GND 0,10.16; LIGHT 0,7.62; RST 0,-7.62; VCC 0,5.08
DIL04 = drill 0.813 offset: 1 -1.27,-3.81; 2 1.27,-3.81; 3 1.27,3.81; 4 -1.27,3.81
SOT23' = smd 0.9 x 1.2: 1 -0.95,-1.2; 2 0.95,-1.2; 3 0,1.2
HC49U-V = drill 0.813: 1 -2.413,0; 2 2.413,0
SSOT-6 = smd 0.7 x 1: 1 -0.95,-1.325; 2 0,-1.325; 3 0.95,-1.325; 4 0.95,1.325; 5 0,1.325; 6 -0.95,1.325
R1206 = smd 1.6 x 1.803: 1 -1.422,0; 2 1.422,0
TACTILE-SWITCH-SMD = smd 1.524 x 0.762: 1 -2.794,1.905; 2 2.794,1.905; 3 -2.794,-1.905; 4 2.794,-1.905
F/CM12P = drill 1.016 pad 2.54 octagon: + 3.81,0; - -3.81,0
2PT_GND_TIE = smd 1.27 x 0.635: P$1 0,0.635; P$2 0,-0.635
PS22_L02_DPDT_SW = drill 1.3: P$1 0,0; P$2 3.2,0; P$3 6.4,0; P$4 0,3; P$5 3.2,3; P$6 6.4,3; P$7 -2.6,-1.6; P$8 9,4.6
SK12SWITCH = drill 0.8: IN 0,0; P1 0,2; P2 0,-2 | drill 1.2: PIN1 0,4.191; PIN2 0,-4.191
1X03 = drill 1.016 pad 1.88: 1 0,0; 2 2.54,0; 3 5.08,0
SOP8 = smd 0.76 x 1.27: 1 -1.905,-2.86; 2 -0.635,-2.86; 3 0.635,-2.86; 4 1.905,-2.86; 5 1.905,2.86; 6 0.635,2.86; 7 -0.635,2.86; 8 -1.905,2.86
SO016 = smd 0.6 x 1.2: 1 -4.445,-2.8; 2 -3.175,-2.8; 3 -1.905,-2.8; 4 -0.635,-2.8; 5 0.635,-2.8; 6 1.905,-2.8; 7 3.175,-2.8; 8 4.445,-2.8; 9 4.445,2.8; 10 3.175,2.8; 11 1.905,2.8; 12 0.635,2.8; 13 -0.635,2.8; 14 -1.905,2.8; 15 -3.175,2.8; 16 -4.445,2.8
SOT23-6L = smd 0.55 x 1.2: 1 -0.95,-1.3; 2 0,-1.3; 3 0.95,-1.3; 4 0.95,1.3; 5 0,1.3; 6 -0.95,1.3
SOT23-5 = smd 0.55 x 1.2: 1 -0.95,-1.3; 2 0,-1.3; 3 0.95,-1.3; 4 0.95,1.3; 5 -0.95,1.3
SOT223 = smd 1.219 x 2.235: 1 -2.311,-3.099; 2 0,-3.099; 3 2.311,-3.099 | smd 3.6 x 2.2: 4 0,3.099
TQFP-48 = smd 1.5 x 0.28: 1 -4.25,2.75; 2 -4.25,2.25; 3 -4.25,1.75; 4 -4.25,1.25; 5 -4.25,0.75; 6 -4.25,0.25; 7 -4.25,-0.25; 8 -4.25,-0.75; 9 -4.25,-1.25; 10 -4.25,-1.75; 11 -4.25,-2.25; 12 -4.25,-2.75; 25 4.25,-2.75; 26 4.25,-2.25; 27 4.25,-1.75; 28 4.25,-1.25; 29 4.25,-0.75; 30 4.25,-0.25; 31 4.25,0.25; 32 4.25,0.75; 33 4.25,1.25; 34 4.25,1.75; 35 4.25,2.25; 36 4.25,2.75 | smd 0.28 x 1.5: 13 -2.75,-4.25; 14 -2.25,-4.25; 15 -1.75,-4.25; 16 -1.25,-4.25; 17 -0.75,-4.25; 18 -0.25,-4.25; 19 0.25,-4.25; 20 0.75,-4.25; 21 1.25,-4.25; 22 1.75,-4.25; 23 2.25,-4.25; 24 2.75,-4.25; 37 2.75,4.25; 38 2.25,4.25; 39 1.75,4.25; 40 1.25,4.25; 41 0.75,4.25; 42 0.25,4.25; 43 -0.25,4.25; 44 -0.75,4.25; 45 -1.25,4.25; 46 -1.75,4.25; 47 -2.25,4.25; 48 -2.75,4.25
BANANA_6MMHOLE = drill 6.02 pad 8.89: P$1 0,0

### Placement (x,y rotation side)
BATT  81.1,40.3 90 top
BTN1  58,95 270 top
BTN2  66,95 270 top
BTN3  74,95 270 top
BTN4  82,95 270 top
C1  11,78 90 top
C2  8,78 90 top
C3  30.04,71.51 270 top
C4  19,85 90 top
C5  31.79,84.04 0 top
C6  6.7,96.7 90 top
C7  14.5,31 90 top
C8  41.1,83.5 180 top
C9  40.23,97.75 180 top
C10  3,56 270 top
C11  7,41 90 top
C12  15.3,89.1 0 top
C13  16,85 90 top
C14  73.91,88.96 180 top
C15  66.26,88.96 180 top
C16  57.61,88.96 180 top
C17  41.1,81.1 180 top
C18  34,94 0 top
C19  3.8,26 0 top
C20  3.8,17.4 180 top
C21  15.3,91.7 0 top
C22  25.4,33.5 270 top
C23  82,89 0 top
C24  88.2,53.9 180 top
C25  80.8,50 270 top
C26  40.2,95.1 0 top
C27  32.8,71.5 270 top
C28  80.8,73.3 270 top
C29  9.6,31 90 top
C30  84.7,67.9 180 top
C31  19.5,31 270 top
C32  4,64 270 top
CLB  4,40 90 top
CLT  53,90 90 top
CRB  48,40 90 top
CRT  97,90 90 top
CT  85,86 0 top
D1  39,29 90 top
D2  98.3,38.3 0 top
D3  22,31 90 top
D4  98.3,44 0 top
D5  16,60 180 top
F1  35,19 0 top
FB1  1.8u  [1206']  4.47,77.94 270 top
I2C  48,61.4 270 top
IC1  40,87 0 top
IC2  11,41 180 top
IC3  7,64 0 top
IC4  7.6,56.1 0 top
IC5  3.1,22.1 0 top
IC6  9.7,21.7 90 top
IC8  28,30 0 top
IC9  30,34 0 top
J1  87.8,82.3 270 top
J2  97.8,77.3 270 top
K2  36,28 180 bottom
M1  21.99,97.34 270 top
OK1  82.8,59.3 0 top
OK2  93.5,59.3 0 top
PWR  48,85.3 90 top
Q1  2N3904-MMBT  [SOT23']  43,29 0 top
Q2  9.5,88.6 270 top
Q3  85.8,35.3 0 top
Q4  2N3904-MMBT  [SOT23']  31,53 90 top
R1  95.5,38.4 270 top
R2  13.9,63.8 90 top
R3  12,31 270 top
R4  7.1,31 270 top
R5  31.3,57.2 180 top
R6  17,31 90 top
R7  29,27 180 top
R8  29,24 180 top
R10  41,24 180 top
R11  38.4,71.5 270 top
R12  35.7,71.5 270 top
R13  81.8,36.3 90 top
R14  86.8,59.4 90 top
R15  92.7,67.3 0 top
R16  96.8,33.3 0 top
R17  34,88 180 top
R18  34,91 0 top
R19  88.8,31.3 0 top
R20  36.4,51.3 270 top
R21  89.3,59.3 270 top
R22  97.4,59.3 270 top
R23  11.9,50.7 0 top
R24  6.2,50.7 0 top
R25  11.5,56 270 top
R26  14,56 90 top
R34  40.1,38.3 90 top
R35  42.5,38.3 90 top
R36  45,38.3 90 top
R37  37.8,38.3 270 top
R38  41.8,51.3 90 top
R39  39,51.3 90 top
RST  3,90 90 top
SG1  22,53 0 top
SJ1  2,78 180 top
SW1  85.2,47.6 0 top
SW2  48,77 0 top
SWD  48,64 90 top
U1  88.8,41.3 270 top
U2  87.8,73.3 0 top
U3  90.8,35.3 0 top
U4  40.3,91.7 0 top
U5  91.4,94.8 0 top
U$1  24.61,78.35 0 top
U$5  7,10 0 top
U$6  19,10 0 top
U$11  31,10 0 top
U$12  43,10 0 top

### Tracks (layer width: path | path; a pad name or v marks a point on that pad's centre or on a via)
1.25V  (via drill 0.35)
  Top 0.254: v9.4,69 9.4,69.8 15.2,75.6 U$1.12 | IC6.8 IC6.7 7.02,21 IC5.2 4.05,21.65 v5,22.6 | IC6.8 7.08,19.28 C20.1 | IC6.8 7.5,19.8 12.15,15.15 | R7.2 27.35,27.23 IC8.1 27.35,29.75 28,30.4 IC8.5 | R23.2 15.7,53.08 15.7,55.9 14.18,57.42 R26.2 10.5,60.92 v10.5,61.6 | v7.5,36.4 10.05,38.95 IC2.4
  Top 1.27: R7.2 R8.2 21,24 12.15,15.15 U$5.P$1
  Bottom 0.254: 9.4,61.5 9.4,58.7 8.2,57.5 8.2,38 7.1,36.9 | 9.4,61.5 v9.4,69 | v10.5,61.6 9.5,61.6 9.4,61.5 | v5,22.6 2.7,24.9 2.7,32.5 7.1,36.9 | 7.1,36.9 7.1,36.8 v7.5,36.4
2.5V  (via drill 0.35, 0.4)
  Top 0.254: U$1.36 28.86,82.51 29.18,82.83 | U$1.24 28.55,72.91 C3.1 | U$1.48 21.86,83.44 21.15,84.15 v21.1,84.2 | 22.75,36.05 22.85,36.15 24.05,34.95 | C19.1 1.9,25.5 1.9,25.3 | 2.5,27.5 2.4,27.4 | U4.3 41.25,89.35 v41.1,89.2 | 24.05,34.95 24.1,34.9 C22.1 27.9,34.9 28.39,34.41 29.57,34.41 29.57,34.4 29.7,34.4 30,34.7 IC9.5 | IC8.3 29.45,29.05 v29.5,29.1 | 24.05,34.95 24.05,34.65 v23.6,34.2 23.6,30.9 D3.C | C32.1 5.1,64.3 6.6,64.3 7,64.7 IC3.5
  Top 0.508: FB1.1 4.3,79.56 4.47,79.73 4.47,81.37 v5.1,82 | v28.4,83.7 29.18,82.92 29.18,82.83 C5.1 | 21.15,84.15 20.6,83.6 C4.1 18.5,83.6 v17.5,84.6 | v7.2,38.2 7,38.4 C11.1 8.4,41 10.3,41 11,40.3 IC2.5 11,38.1 12,37.1 | C3.1 C27.1 34.5,74.6 39.7,74.6 v43.3,71 | v13.4,37.1 12,37.1 | 22.75,36.05 13.05,36.05 12,37.1 | v3.7,28.7 2.5,27.5 | 2.4,27.4 C19.1 | IC5.1 1.9,21.25 1.9,25.3 | v14.2,26.9 14.2,23.1 | 14.2,23.1 14.2,20.2 13.79,19.8 IC6.1 | IC6.3 13.44,22.34 14.2,23.1 | SW2.IN 46.6,77 C17.1 43.9,81.1 v44,81.2 | v1.7,73.5 1.7,67.7 | 1.7,67.7 C32.1 | 1.7,67.7 1.7,58.7 C10.1 | C10.1 3.4,57.4 | C10.1 4.32,58.72 IC4.8 | v4.7,57.3 4.6,57.4 C10.1
  Bottom 0.254: 27.9,84.2 28.05,84.05 | v41.1,89.2 44,86.3 44.7,86.3 45.3,85.7 45.3,80.7 44.3,79.7 43.3,78.7 | v29.5,29.1 25.5,29.1 24.6,30 24.6,33.2 v23.6,34.2
  Bottom 0.508: v21.1,84.2 27.9,84.2 28.1,84.2 30.3,82 40,82 43,79 | 28.05,84.05 v28.4,83.7 | 43,79 43.3,78.7 v43.3,71 | v7.2,38.2 7.2,54.4 4.7,56.9 v4.7,57.3 | v17.5,84.6 15.6,84.6 13,82 v5.1,82 5.1,76.9 v1.7,73.5 | 43,79 43.6,79 44.3,79.7 44.3,80.9 v44,81.2 | v3.7,28.7 13,28.7 | 13,28.7 13.4,28.7 15.7,31 15.7,34.8 v13.4,37.1 | 13,28.7 14.2,27.5 v14.2,26.9
2V5_STDBY  (via drill 0.35)
  Top 0.254: U$1.1 18.5,81.1 C13.1 15.4,83.6 v14.2,84.8 | IC1.2 40.95,86.75 v41.4,87.2
  Top 0.508: IC1.2 42.5,84.35 C8.1 43.5,83.5 45.95,81.05 45.95,79.95 46.9,79 SW2.P1
  Bottom 0.254: v41.4,87.2 38.1,90.5 19.9,90.5 v14.2,84.8
3V  (via drill 0.35)
  Top 0.508: 38.67,95.23 C26.1 | K2.1 39,27.19 D1.C | R12.1 R11.1 39.88,72.92 41.9,70.9 41.9,67.5 I2C.1 | v26.3,48.9 27.8,48.9 31,52.1 31,54.5 32.72,56.22 R5.1 33.02,56.9 v39,56.9 | U4.5 39.35,94.55 C26.1 | v37,96 37.9,96 C26.1
  Bottom 0.508: v39,56.9 43.5,56.9 I2C.1 46.3,63.1 46.3,86 38.5,93.8 37,93.8 | M1.VCC 27.07,95.67 27,95.6 28.8,93.8 37,93.8 | 37,93.8 v37,96 | K2.1 34.7,25.49 34.7,35 32.1,37.6 32.1,41.5 26.3,47.3 v26.3,48.9
5V  (via drill 0.35)
  Top 0.254: C28.1 v80.8,76.3 | v90.5,77.8 90.5,78.09 89.05,79.55 J1.VBUS1 | 87.8,72.3 87.8,68.3 | 86,55.5 86.01,55.49 OK2.1 92.23,55.3 92.23,53.3 | U2.16 83.36,75.44 84.3,74.5 v85.9,74.5
  Top 0.508: v85.9,74.5 85.9,74.2 87.8,72.3 | 87.8,68.3 87.8,61.82 R14.2 86.68,60.7 v84.9,60.7 | v83.6,57.9 86,55.5 | 86.01,55.49 86.2,55.3 92.23,55.3 | OK2.1 92.23,53.3 92.1,53.3 90,51.2 90,49.2 SW1.P$2
  Bottom 0.254: v80.8,76.3 82.6,74.5 v85.9,74.5
  Bottom 0.508: v90.5,77.8 87.2,74.5 v85.9,74.5 | v84.9,60.7 84.9,59.2 v83.6,57.9
5V_ISO  (via drill 0.35)
  Top 0.254: SW1.P$1 86.85,49.25 86.85,51.45 87.7,52.3 88,52.3 C24.1 | R1.1 94.02,39.82 v93.8,39.6 | v93,44.3 91.91,43.2 U1.8
  Top 0.508: SW1.P$1 89.59,43.2 | 89.59,43.2 89.3,43.2 89.1,43.01 89.1,39.9 88.59,39.4 U1.4 | 89.59,43.2 U1.8
  Bottom 0.254: v93.8,39.6 93,40.4 v93,44.3
ADC_VBAT  (via drill 0.4)
  Top 0.254: v30.5,87.9 31.88,87.9 R17.2 | U$1.10 21.7,76.6 v23,77.9
  Top 0.508: C18.1 32.6,91.02 R18.1 R17.2
  Bottom 0.254: v23,77.9 20.1,80.8 20.1,84.4 23.6,87.9 v30.5,87.9
ADCI  (via drill 0.35)
  Top 0.254: IC8.6 26.8,30.4 v25.6,30.4 | U$1.18 24.36,69.04 25.3,68.1 25.3,66.3 v24.9,65.9
  Bottom 0.254: v24.9,65.9 23.3,64.3 23.3,62.9 29.1,57.1 29.1,51.7 27.3,49.9 26.1,49.9 25.4,49.2 25.4,47 25.6,46.8 v25.6,30.4
ADCV
  Top 0.254: U$1.11 14.4,76.1 7.95,69.65 IC3.4
AGND  (via drill 0.35, 0.4)
  Top 0.254: U$1.8 13.8,77.6 12,79.4 C1.2 | C11.2 6.1,42.4 5.5,41.8 5.5,37.9 | 10.6,23 10.6,23.2 10.2,23.61 IC6.5 | 12,23.61 IC6.4 | C20.2 2.4,19.2 3.1,19.9 3.1,22.9 IC5.3 | C22.2 27,33.7 29.7,33.7 30,33.4 IC9.2 30,31.2 28.8,30 28.5,30 28,29.5 IC8.2 | C32.2 5.2,63.8 6.6,63.8 | 6.6,63.8 7,63.4 IC3.2 | 6.6,63.8 10.8,63.8 v10.9,63.7 | 9.2,55.2 9.9,55.9 v10.1,55.9
  Top 0.508: C1.2 C2.2 6.6,78 3.6,78 2.9,77.3 2.83,77.36 2.61,77.36 | IC2.2 11,44 | 11,44 11,44.3 10.3,45 7.6,45 7,44.4 C11.2 | 11,44 v12.1,45.1 | v7.6,72.4 5.3,72.4 2,75.7 2,76.5 2.25,76.75 | 2.61,77.36 1.39,77.36 | 2.61,77.36 2.61,77.11 2.25,76.75 | SJ1.P$1 2.25,77.12 2.25,76.75 | IC6.2 11.04,21.07 10.6,21.5 10.6,23 9.99,23.61 IC6.5 | 10.6,23.2 11.01,23.61 12,23.61 | IC6.5 IC6.6 | 5.2,25.49 IC6.5 | 3.1,22.9 5.2,25 5.2,25.49 | 5.2,25.49 C19.2 5.2,28 | 5.5,37.9 5.2,37.6 5.2,28 | C10.2 4.1,54.6 4.9,55.4 9,55.4 9.2,55.2 9.51,54.9 IC4.4 | C22.2 24.5,31.2 24.5,29.3 22,26.8 19.1,26.8 17.9,28 5.2,28
  Bottom 0.254: v10.9,63.7 12,63.7 | v10.1,55.9 11.9,55.9 12,55.8
  Bottom 0.508: v7.6,72.4 9.9,72.4 12,70.3 12,63.7 12,55.8 12,45.2 v12.1,45.1
BTN1  (via drill 0.35)
  Top 0.254: CLB.1 2.2,41.8 2.2,48.5 2.9,49.2 6,49.2 7,48.2 17.3,48.2 20.8,51.7 20.8,59.2 20.1,59.9 20.1,67.9 18.6,69.4 18.6,70.9 v18.7,71 | v26.1,79.7 27,78.8 27,78.3 27.7,77.6 U$1.29
  Bottom 0.254: v26.1,79.7 26.1,74.8 23.3,72 19.7,72 v18.7,71
BTN1T  (via drill 0.35)
  Top 0.508: BTN1.1 58.6,96.59 58.6,90.8 59.01,90.39 C16.1 59.05,89 v60.7,89
  Bottom 0.508: CLT.1 54,89 v60.7,89
BTN2  (via drill 0.35)
  Top 0.254: v30.5,76.8 30.3,76.6 U$1.27 | CLB.2 7.96,46.5 17.7,46.5 22.1,50.9 22.1,60.3 21.5,60.9 21.5,69.6 v21.3,69.8
  Bottom 0.254: v30.5,76.8 29.6,76.8 22.6,69.8 v21.3,69.8
BTN2T  (via drill 0.35)
  Top 0.508: C15.1 66.5,90.12 66.5,93.5 | BTN2.1 66.5,96.49 66.5,93.5 | v65.2,93.5 66.5,93.5
  Bottom 0.508: CLT.2 54.14,92.54 55.1,93.5 v65.2,93.5
BTN3  (via drill 0.35)
  Top 0.254: v27,77.3 27.2,77.1 U$1.28 | CLB.3 5.18,45.08 7.5,47.4 17.7,47.4 21.5,51.2 21.5,59.8 20.8,60.5 20.8,68.8 19.8,69.8 v19.8,70.1
  Bottom 0.254: v27,77.3 27,75 23.1,71.1 20.8,71.1 v19.8,70.1
BTN3T  (via drill 0.35)
  Top 0.508: C14.1 74.5,89.77 74.5,94.7 | BTN3.1 74.5,96.49 74.5,94.7 | v73.6,94.8 74.4,94.8 74.5,94.7
  Bottom 0.508: CLT.3 73.32,95.08 v73.6,94.8
BTN4
  Top 0.254: CRB.1 45.7,42.3 45.7,56.7 38,64.4 28,64.4 26,66.4 26,68.5 24.86,69.64 U$1.19
BUZZ  (via drill 0.35)
  Top 0.254: U$1.33 34.8,79.6 v38.1,76.3 | R20.1 41.3,57.62 v41.3,58.2
  Bottom 0.254: v38.1,76.3 42.4,72 42.4,59.3 v41.3,58.2
GND  (via drill 0.35)
  Top 0.254: 22.6,81.2 22.36,81.44 U$1.47 22.36,85 20.96,86.4 C4.2 | 22.6,81.2 23.6,81.2 23.86,81.46 U$1.44 | C5.2 33.2,81.7 32.25,80.75 32.1,80.6 U$1.35 25.6,80.6 25.2,80.2 23.6,80.2 22.6,81.2 | RST.1 5.29,91.4 | 37,89.42 v37,89 | 39.3,80.8 39.1,81 | v30.1,68.4 30.1,70.05 C3.2 29.11,70.11 29,70 26.86,72.14 U$1.23 26.86,75.64 25.7,76.8
  Top 0.508: RST.1 1.09,85.91 2,85 | C13.2 C4.2 | C3.2 31.4,70.1 | 32.25,80.75 33.95,80.75 v34,80.8 | Q1.2 43.95,26.05 v44,26 | SJ1.P$2 v2,80
  Bottom 0.508: 34.8,96.6 34.8,97.29 | 21,94.6 21,94.9
  other vias: 40.7,79.3 20,47 38.1,55.8 38.4,60.7 15,67
  pour Bottom (isolate 0.406): 0,100 50,100 50,0 0,0
  pour Top (isolate 0.406): 0,100 50,100 50,0 0,0
GND-ISO
  Top 0.254: J1.SHIELD1 J1.SHIELD2 J1.SHIELD3 84.12,78.92 83.8,78.6 | J1.GND1 86.5,78.9 86.2,78.6 84.8,78.6 83.8,78.6 | 83.8,78.6 83.1,78.6 | C28.2 82.5,73.6 82.6,73.7 83.36,72.94 83.36,70.6 U2.1 83.36,70.3 83.36,67.95 C30.2
  Top 0.508: 84.8,78.6 83.1,78.6 82.6,78.1 82.6,73.7 | 82.5,73.6 83.36,72.75 83.36,70.6 | 83.36,70.6 83.36,70.3 | 83.36,70.6 83.3,70.55 C30.2 83.3,63.88 OK1.3
  Bottom 0.508: OK1.3 82.8,61.84 82.8,50.1 83.8,49.1 86.9,49.1 SW1.P$5
GNDIO
  Top 0.254: 82.06,35.14 R13.1 85.38,31.3 R19.1 | 94.88,63.22 OK2.3 | SW1.P$4 85.2,52.3 C24.2
  Top 0.508: Q3.5 85.8,35.9 85.2,35.3 83.8,35.3 | 82.06,35.14 82.22,35.3 83.8,35.3 | J2.4 97.8,66.3 94.88,63.38 94.88,63.22 | C25.2 83.2,48.6 | 83.2,48.6 SW1.P$4 | 83.8,35.3 83.8,39.3 85.2,40.7 85.23,40.66 U1.3 87.53,40.66 87.6,40.6 88.1,41.1 88.1,42.6 87.5,43.2 U1.1 84.8,44.34 84.8,45.7 84.1,46.4 84.1,46.5 83.7,46.9 83.7,48.1 83.2,48.6
  Bottom 0.508: OK2.3 85.2,53.54 SW1.P$4
ISEL
  Top 0.254: R10.2 40.6,25.02 40.6,28.6 40,29.2 36.3,29.2 34.7,30.8 34.7,35.2 33.4,36.5 33.4,36.8 | U$1.14 22.36,61.24 23,60.6 23,49 33.4,38.6 33.4,36.8 | IC9.6 29.05,36.25 29.6,36.8 33.4,36.8
LCD_CLK
  Top 0.254: U$1.39 26.36,88.4 24.53,90.23 M1.CLK
LCD_DC
  Top 0.254: U$1.45 23.36,89.34 19.4,93.3 19.45,93.35 M1.DC
LCD_DIN
  Top 0.254: U$1.41 25.36,83.96 25.8,84.4 25.8,87.9 25.45,88.25 25.3,88.4 21.99,91.71 M1.DIN
LCD_RST
  Top 0.254: U$1.46 22.86,88.85 M1.RST
LED
  Top 0.254: D5.A 17.5,67.4 16.4,68.5 16.4,74.3 16.9,74.8 21.3,74.8 21.86,74.24 U$1.13
N$1  (1 unrouted)
  Top 0.254: U$1.7 14.9,78.1 10.4,82.6 6.2,82.6 4.91,83.89 RST.3 | 6,95.3 C6.1
N$2
  Top 0.254: U$1.5 16.4,79.1 10.9,84.6 10.9,89.61 Q2.1 13.21,91.01 C21.1
N$3  (via drill 0.35)
  Top 0.254: C7.1 12.02,29.6 R3.2 13.2,30.78 v13.2,30.9
  Top 0.508: v12.2,43.6 11.95,43.35 IC2.1
  Bottom 0.254: v12.2,43.6 10.5,41.9 10.5,33 | 10.5,33 10.5,32.5 | 10.5,33 12.6,30.9 v13.2,30.9
N$4  (via drill 0.35)
  Top 0.254: C29.1 9.58,29.58 R4.2 7.1,29.7 v8.4,31 | v9.7,43.9 10.05,43.55 IC2.3
  Bottom 0.254: v8.4,31 9.7,32.3 v9.7,43.9
N$5  (via drill 0.35)
  Top 0.254: 17.28,32.7 R6.2 | R6.2 17.02,32.4 C31.1 21.7,32.4 D3.A | R4.1 9.58,32.42 C29.2 | C29.2 11.98,32.4 R3.1 14.48,32.42 C7.2 16.98,32.4 R6.2 | C29.2 8.6,33.4 v8.6,36.4 | v10.9,59.4 10.22,58.72 IC4.5
  Bottom 0.254: v8.6,36.4 9,36.8 9,43.1 8.8,43.3 8.8,44.6 9,44.8 9,57.5 v10.9,59.4
N$6
  Top 0.508: Q1.1 42.05,24.37 R10.1
N$7
  Top 0.254: 46.07,31.9 K2.P@
  Top 0.508: 45.64,24.19 K2.P
  Top 1.016: F1.2A 45.41,23.44 K2.P
  Top 1.27: K2.P K2.P@
N$8
  Top 0.254: U$1.9 11.5,77.1 C1.1
  Top 0.508: FB1.2 7.89,76.49 C2.1 C1.1
N$9  (via drill 0.35)
  Top 0.254: v19.5,28.1 C31.2 17.02,29.6 R6.1
  Top 0.508: 17,29 R6.1
  Bottom 0.254: U$6.P$1 19,27.6 v19.5,28.1
N$10  (via drill 0.35)
  Top 0.254: IC9.1 v28.1,32.7
  Top 1.27: R8.1 30.61,24.19 K2.S
  Bottom 0.254: v28.1,32.7 33.46,27.34 K2.S
N$11
  Top 0.508: K2.2 37.89,31.81 D1.A 42.5,30.7 Q1.3
N$12
  Top 0.254: IC9.3 31.85,31.81 K2.O
  Top 1.27: R7.1 31.5,27 33.5,29 33.46,29.04 K2.O
N$13  (via drill 0.35)
  Top 0.254: D2.A 95.93,36.55 R1.2 96.72,38.2 v97.3,38.2 | v97.8,44.2 98.3,43.7 D4.A
  Bottom 0.254: v97.3,38.2 97.3,43.7 v97.8,44.2
N$14  (via drill 0.35)
  Top 0.508: BTN3.3 71.74,94.96 73.4,93.3 73.4,89.85 C14.2 71.04,88.96 v71,89 | C15.2 64.82,89 v63,89 | C16.2 57.5,90.25 57.5,96.49 BTN1.3 | v79,89 C23.1
  Bottom 0.508: CLT.4 55.11,97.62 BTN1.3 55.74,97.96 57.3,96.4 61.89,96.4 | BTN2.3 61.89,96.4 | 61.89,96.4 69.89,96.4 | 69.89,96.4 BTN3.3 | 69.89,96.4 77.89,96.4 BTN4.3 | v63,89 v71,89 v79,89
N$15
  Top 0.254: D5.C 13.9,60.6 R2.1
N$16
  Top 0.254: R5.2 29.88,57.07 SG1.+
N$17
  Top 0.508: CRT.1 95.58,88.58 83.82,88.58 C23.2 82.5,89.9 82.5,96.49 BTN4.1
N$18  (via drill 0.35)
  Top 0.254: IC8.4 28.65,31.65 28.4,31.9 27.3,31.9 v27,32.2 | v31.9,34 30.95,34.95 IC9.4
  Bottom 0.254: v27,32.2 27,33.1 27.9,34 v31.9,34
N$21  (via drill 0.35)
  Top 0.254: U$1.6 15.8,78.6 9.5,84.9 Q2.2 | C12.1 12.8,88 v12.8,87.6
  Bottom 0.254: v12.8,87.6 10.91,87.6 Q2.2
N$22
  Top 1.016: U$11.P$1 24.59,16.41 F1.1A
N$23
  Top 0.254: D2.C 96.55,41.8 94.3,41.8 93.17,40.66 U1.6
N$25
  Top 0.254: U1.7 92.73,41.94 96.62,45.83 98.38,45.83 D4.C
N$26
  Top 0.254: R13.2 82.9,38.82 82.9,39.3 85.53,41.94 U1.2
N$27
  Top 0.254: U2.4 87.17,68.97 C30.1
N$28
  Top 0.254: R21.2 92.38,57.88 OK2.2
N$29  (via drill 0.35)
  Top 0.254: v90.2,64.8 90.2,66.22 R15.1
  Bottom 0.254: OK1.2 90.2,61.62 v90.2,64.8
N$30
  Top 0.254: U3.5 90.8,37.3 91.4,37.9 92.1,37.9 93.1,36.9 93.1,35.58 R16.1
N$31  (via drill 0.35)
  Top 0.254: Q3.2 85.8,34.5 86.4,35.1 | 88.2,35.1 88.9,35.1 89.85,36.05 U3.6
  Top 0.508: 86.4,35.1 88.2,35.1 v88.2,37
  Bottom 0.508: v88.2,37 82.36,42.84 BATT.2
N$32
  Top 0.254: Q3.6 84.85,37.25 85.3,37.7 86.4,37.7 86.8,37.3 86.75,37.25 Q3.4
N$33
  Top 0.254: Q3.3 86.78,34 U3.1
N$34
  Top 0.254: Q3.1 84.85,33.45 85.4,32.9 91.5,32.9 91.7,33.1 91.7,33.95 U3.3
N$35
  Top 0.254: R19.2 91.3,31.3 92.7,32.7 92.7,34.7 92.2,35.2 91.2,35.2 90.8,34.8 U3.2
N$36  (via drill 0.35)
  Top 0.254: v26.5,50.8 28.7,53 Q4.3
  Bottom 0.254: SG1.- 20.39,50.8 v26.5,50.8
N$37
  Top 0.254: R20.2 34.37,49.88 Q4.1
N$39  (via drill 0.35)
  Top 0.254: IC4.1 5.7,51.62 R24.1 3.3,50.7 v3,51 | v6,61.1 6.05,61.15 IC3.1
  Bottom 0.254: v3,51 3,58.1 v6,61.1
N$40
  Top 0.254: IC4.2 6.96,51.36 R24.2 R23.1
N$41
  Top 0.254: IC4.3 8.23,52.47 8.8,51.9 10.1,51.9 10.7,52.5 10.7,53.78 R25.2 R26.1
N$42
  Top 0.254: IC3.3 7.95,61.35 8.23,61.06 IC4.6 8.23,57.27 8.7,56.8 10.88,56.8 R25.1
  Top 0.508: IC4.7 IC4.6
RX  (via drill 0.35)
  Top 0.254: U$1.43 24.36,84.24 24.2,84.4 24.2,86.3 v24.8,86.9 | v42.8,86.1 47.08,90.38 PWR.3
  Bottom 0.254: v24.8,86.9 27.7,86.9 30,84.6 41.3,84.6 v42.8,86.1 | 47.93,90.45 PWR.3
RX_IN  (via drill 0.35)
  Top 0.254: R14.1 85.22,57.98 81.5,61.7 81.53,61.73 OK1.4 | U2.3 v85.89,72.39 v85.9,72.4
  Bottom 0.254: v85.9,72.4 84.1,72.4 81.5,69.8 81.5,63.14 OK1.4
RX_OUT
  Top 0.254: J2.3 96.72,72.22 96.3,71.8 96.3,66.6 95.5,65.8 93.9,65.8 92.23,64.13 OK2.4 94.62,60.72 R22.1
SCL  (via drill 0.35)
  Top 0.254: U$1.21 25.86,70.74 27.5,69.1 27.5,67.5 28.6,66.4 34,66.4 | I2C.3 47.48,56.32 37.4,66.4 34,66.4 | v34.4,68.1 35.7,69.4 R12.2 | v33.9,65.5 33.9,66.3 34,66.4
  Bottom 0.254: v34.4,68.1 34.4,66 v33.9,65.5
SDA
  Top 0.254: U$1.22 26.36,71.24 28.3,69.3 28.3,69 28.3,68 29,67.3 38.3,67.3 38.4,67.2 | I2C.2 46.14,58.86 38.4,66.6 38.4,67.2 | R11.2 38.4,67.2
SWCLK
  Top 0.254: U$1.37 27.36,84 28.86,85.5 34.2,85.5 34.5,85.2 34.5,82.6 46.1,71 46.1,67.6 47.16,66.54 SWD.2
SWDIO
  Top 0.254: SWD.1 46.7,64 45.3,65.4 45.3,70.7 35.9,80.1 U$1.34
TP1A  (via drill 0.35)
  Top 0.254: U$1.15 22.86,62.84 23.8,61.9 23.8,49.68 30.88,42.6 v36.4,42.6 37.8,41.2 R37.1 R34.2
  Bottom 0.254: CRB.2 36.46,42.54 v36.4,42.6
TP1H  (via drill 0.35)
  Top 0.254: v30.4,74.4 30.4,75.7 30,76.1 U$1.26 | v34.3,36.9 34.32,36.88 R37.2
  Bottom 0.254: v30.4,74.4 28.6,72.6 28.6,66.5 32.9,62.2 32.9,38.2 34.2,36.9 v34.3,36.9
TP1L  (via drill 0.35)
  Top 0.254: v35.2,77.8 34.2,77.8 32.9,79.1 U$1.32 | v40.1,35.1 R34.1
  Bottom 0.254: v35.2,77.8 35.2,71.6 37,69.8 37,52 35.3,50.3 35.3,39.5 39.7,35.1 v40.1,35.1
TP2A  (via drill 0.35)
  Top 0.254: U$1.16 23.36,64.24 v24.3,63.3 | v36.5,45.1 33.3,45.1 v31.8,43.6 | R38.1 v41.8,45.8 42.5,45.1 R35.2
  Bottom 0.254: CRB.3 41.7,45.08 | 41.7,45.08 36.52,45.08 v36.5,45.1 | v31.8,43.6 31.1,43.6 27.5,47.2 27.5,48.7 29.8,51 29.8,57.8 v24.3,63.3 | v41.8,45.8 41.8,45.18 41.7,45.08
TP2H  (via drill 0.35)
  Top 0.254: U$1.25 28.86,74.54 v28.9,74.5 | v32,61.3 33.9,59.4 41.7,59.4 42.2,58.9 42.2,53.12 R38.2
  Bottom 0.254: v32,61.3 27.4,65.9 27.4,73 v28.9,74.5
TP2L  (via drill 0.35)
  Top 0.254: v32.7,78 32.1,78.6 U$1.31 | v42.5,35.2 R35.1
  Bottom 0.254: v32.7,78 32.7,73 36.2,69.5 36.2,52.7 34.5,51 34.5,39.1 39.6,34 42,34 42.5,34.5 v42.5,35.2
TP3A  (via drill 0.35)
  Top 0.254: v25,64.3 23.86,65.44 U$1.17 | v31.2,50.6 31.3,50.6 34.2,47.7 v36.4,47.7 36.82,47.7 R39.1 | v43.9,47 43.9,42.3 45,41.2 R36.2 45.98,39.72 48.9,36.8 48.9,15.9 U$12.P$1
  Top 0.508: U$12.P$1 44.8,11.8
  Bottom 0.254: v36.4,47.7 43.9,47.7 | 43.9,47.7 47.92,47.7 CRB.4 | v43.9,47 43.9,47.7 | v31.2,50.6 31.2,58.1 v25,64.3
TP3H  (via drill 0.35)
  Top 0.254: U$1.20 25.36,70.24 26.8,68.8 26.8,67 28.35,65.45 v30.85,65.45 | R39.2 39,52.5 37.8,51.3 34.6,51.3 34.3,51.6 v34.3,53.9
  Bottom 0.254: v34.3,53.9 34.3,62 v30.85,65.45
TP3L  (via drill 0.35)
  Top 0.254: v31.2,77.8 30.9,78.1 U$1.30 | v45,34.5 R36.1
  Bottom 0.254: v31.2,77.8 31.2,73.4 35.3,69.3 35.3,53.2 33.8,51.7 33.8,38.7 39.5,33 44,33 45,34 v45,34.5
TPA1_TOP  (via drill 0.35)
  Top 0.508: CT.1 CT.2 CT.3 90.08,86.38 91.3,87.6 96.3,87.6 97.7,86.2 CT.6 | v94.1,89.6 89.9,89.6 89.09,90.41 U5.1
  Bottom 0.508: v94.1,89.6 94.1,89.64 95.08,90.62 | CT.6 95.08,88.62 95.08,90.62 | 95.08,90.62 CRT.2
  pour Top (no thermals): 90.2,90.7 90.2,96.1 87.5,96.1 87.5,90.7
TPA2_TOP  (via drill 0.35)
  Top 0.508: U5.4
  Top 1.27: U5.2 v91.4,96 U5.4
  Bottom 0.508: CRT.3 91.4,95.08 | CT.5 91.4,89.76 91.4,95.08 | 91.4,95.08 v91.4,96
  pour Top (no thermals): 95.1,97 87.5,97 87.5,99.1 95.1,99.1
TPA3_TOP
  Top 0.508: CRT.4 93.71,94.33 U5.3
  Bottom 0.508: CRT.4 91.22,97.62 90.1,96.5 90.1,88.52 CT.4
  pour Top (no thermals): 94.8,90.7 92.6,90.7 92.6,96.1 94.8,96.1
TX  (via drill 0.35)
  Top 0.254: v25,85.6 24.86,85.46 U$1.42 | v44.3,85.1 47.04,87.84 PWR.2
  Bottom 0.254: v25,85.6 27.9,85.6 29.7,83.8 43,83.8 v44.3,85.1 | 47.94,87.9 PWR.2
TX_IN  (via drill 0.35)
  Top 0.254: U2.2 84.62,66.28 v85.7,65.2 | v89.1,63.8 89.1,60.92 R21.1
  Bottom 0.254: v85.7,65.2 87.1,63.8 v89.1,63.8
TX_OUT
  Top 0.254: R15.2 94.12,73.22 95.7,74.8 95.74,74.76 J2.2
UD+
  Top 0.254: J1.D+1 87.8,75.4 88.44,74.77 U2.5
UD-
  Top 0.254: J1.D-1 88.45,78.45 88.67,78.23 88.8,78.23 89.1,77.93 89.1,71.9 89.7,71.3 U2.6
V_BATT  (via drill 0.35)  (1 unrouted)
  Top 0.254: R16.2 98.22,33.78 96.9,35.1 94.8,35.1 93.8,36.1 93.8,37.26 U1.5 91.09,39.4 v90.3,38.6 | R22.2 95.42,57.88 94,59.3 84.9,59.3 82.7,61.5 82.7,65.2 82.2,65.7 80.5,65.7 80,65.2 80,56.93 81.53,55.4
  Top 0.508: C25.1 81.53,52.13 81.53,55.4 OK1.1 | BATT.1 82.7,40.3 83.75,41.35 83.75,43.55 83,44.3 81.8,44.3 80.6,45.5 v80.6,45.6 | C9.1 46.46,92.92 | 46.46,92.92 PWR.4 47.24,92.92 | R17.1 39.9,88 | 39.9,88 IC1.3 41.64,88.1 46.46,92.92 | 39.9,88 39.9,88.2 39.35,88.75 U4.1
  Bottom 0.254: BATT.1 82.1,40.3 87.3,35.1 89.5,35.1 89.6,35 90.3,35.7 v90.3,38.6
  Bottom 0.508: J2.1 96.5,77.3 92.7,73.5 82.4,73.5 80,71.1 80,57.02 OK1.1 80.6,54.56 v80.6,45.6
VSEL0  (via drill 0.35)
  Top 0.254: U$1.2 17.6,80.6 v16.7,81.5 | v17.5,73.6 17.5,69.1 19.4,67.2 19.4,57.2 16.2,54 v16.2,49.5 | IC2.6 11.95,40.35 16.2,44.6 v16.2,45.2
  Bottom 0.254: v16.7,81.5 17.5,80.7 v17.5,73.6 | v16.2,45.2 v16.2,49.5
VSEL1  (via drill 0.35)
  Top 0.254: U$1.3 v16.6,80.1 | v9.6,73.6 9.6,72.5 6.05,68.95 IC3.6
  Bottom 0.254: v16.6,80.1 10.1,73.6 v9.6,73.6

### Text on the board
tPlace: 2 | VBAT | RX | 2 | 3 | TX | 1 | G | VBAT | TX | RX | GND | GND | SWCLK | SWDIO | 3V | SDA | SCL | GND | - | + | STM32F1 DMM - embedblog.eu, 2019 v1.3
bPlace: USB UART & CHRG INTERFACE / embedblog.eu, 2019
tNames: MODE | DC/RMS | RANGE | HOLD | COM | VOLT | AMP | TEST